# EAGLE design Glyph Reader Rev 1 (EAGLE 9.7.0)

## Sheet 1 of 2
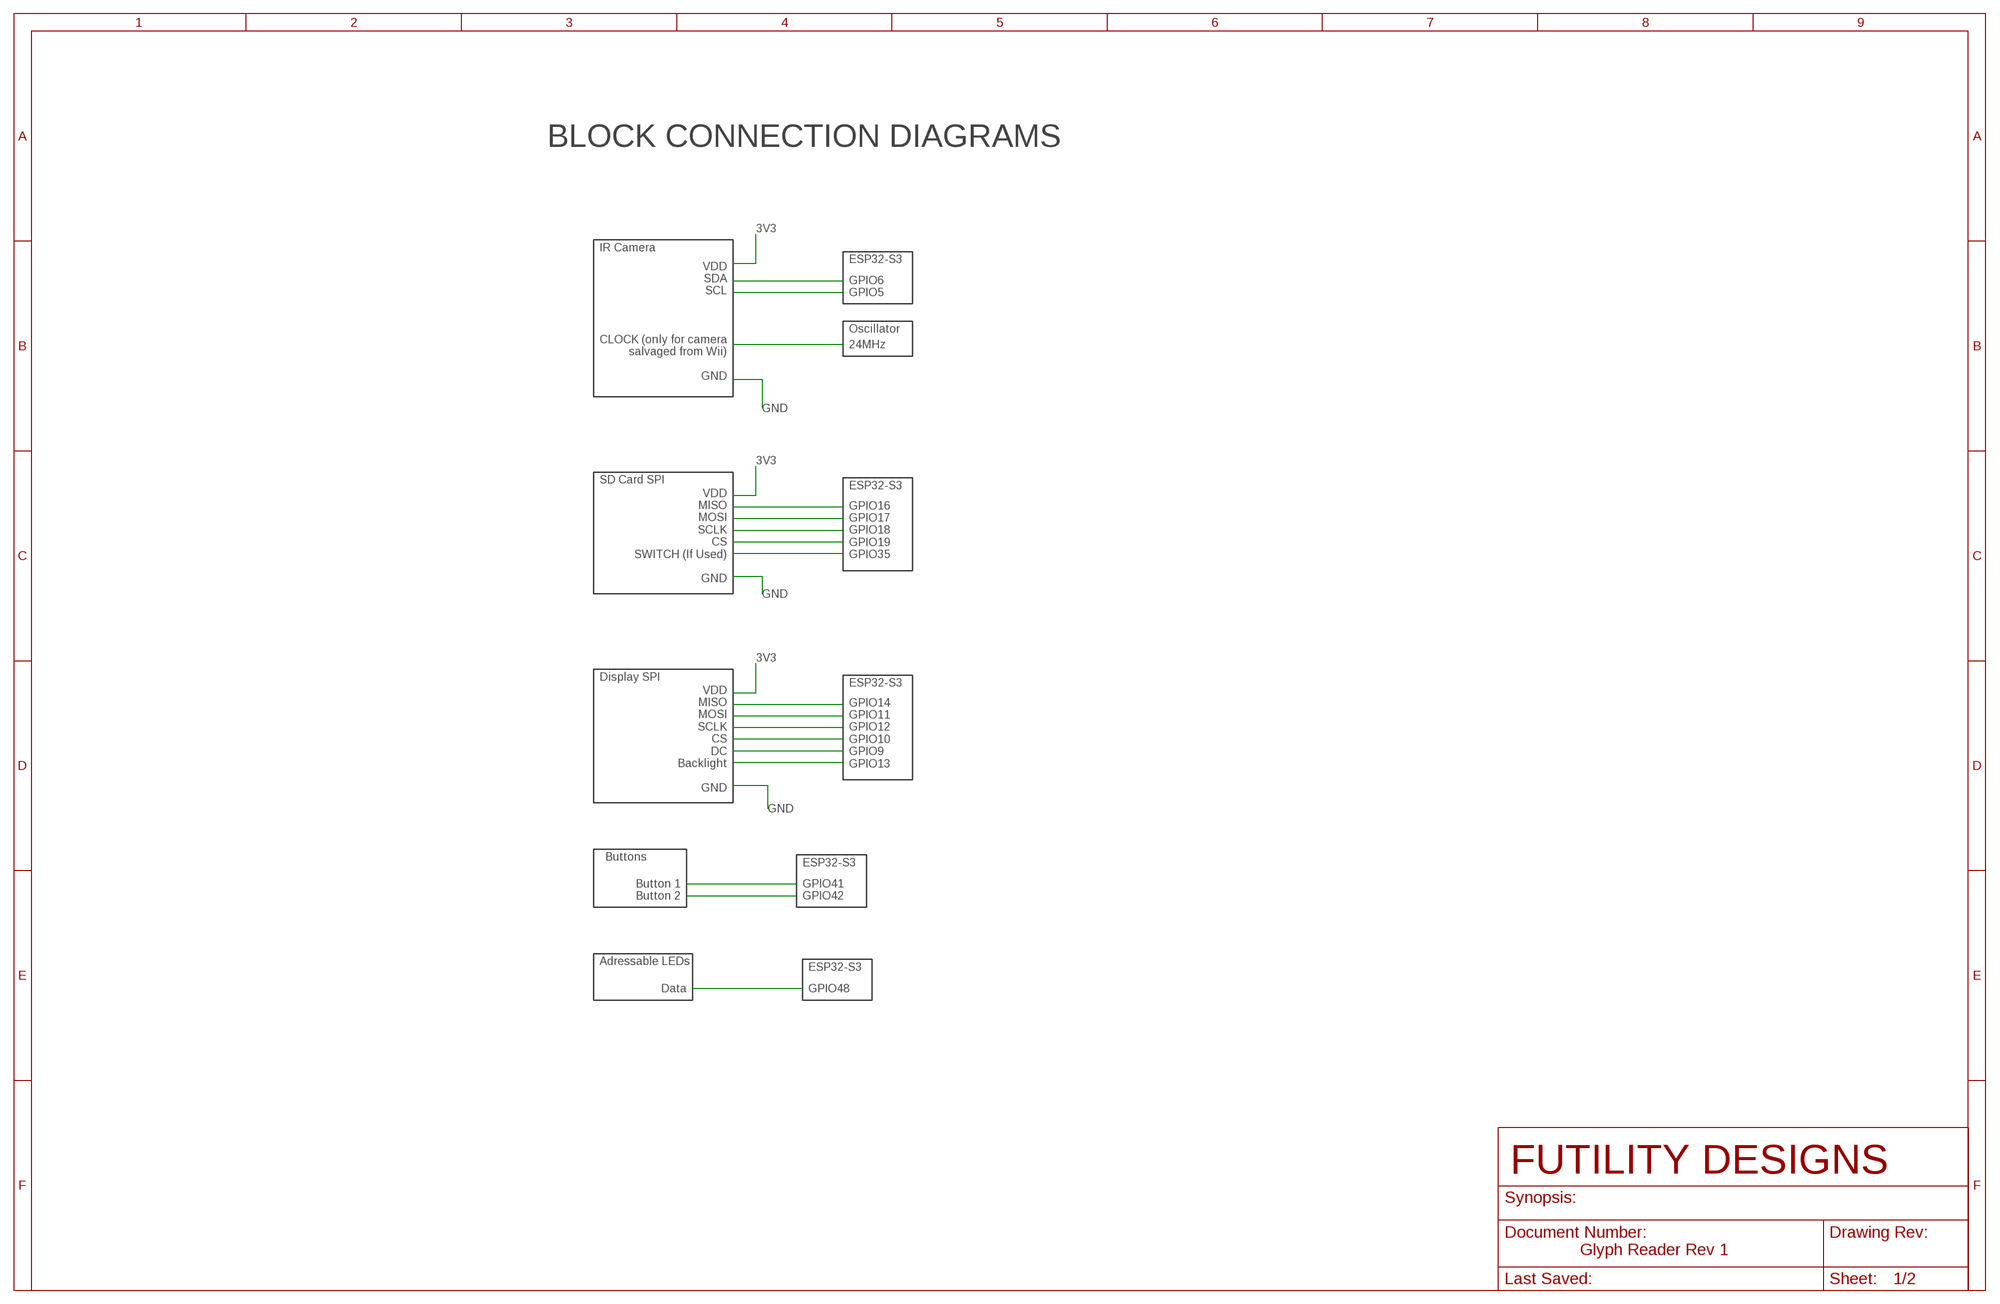
[diagram p0: schematic, sheet 1]

### Notes on the sheet
- BLOCK CONNECTION DIAGRAMS
- 3V3
- IR Camera
- ESP32-S3
- GPIO6
  GPIO5
- VDD
  SDA
  SCL
  
  
  
  CLOCK (only for camera
  salvaged from Wii)
  
  GND
- Oscillator
- 24MHz
- GND
- 3V3
- SD Card SPI
- ESP32-S3
- GPIO16
  GPIO17
  GPIO18
  GPIO19
  GPIO35
- VDD
  MISO
  MOSI
  SCLK
  CS
  SWITCH (If Used)
  
  GND
- GND
- 3V3
- Display SPI
- ESP32-S3
- GPIO14
  GPIO11
  GPIO12
  GPIO10
  GPIO9
  GPIO13
- VDD
  MISO
  MOSI
  SCLK
  CS
  DC
  Backlight
  
  GND
- GND
- Buttons
- ESP32-S3
- Button 1
  Button 2
- GPIO41
  GPIO42
- Adressable LEDs
- ESP32-S3
- Data | GPIO48

## Sheet 2 of 2
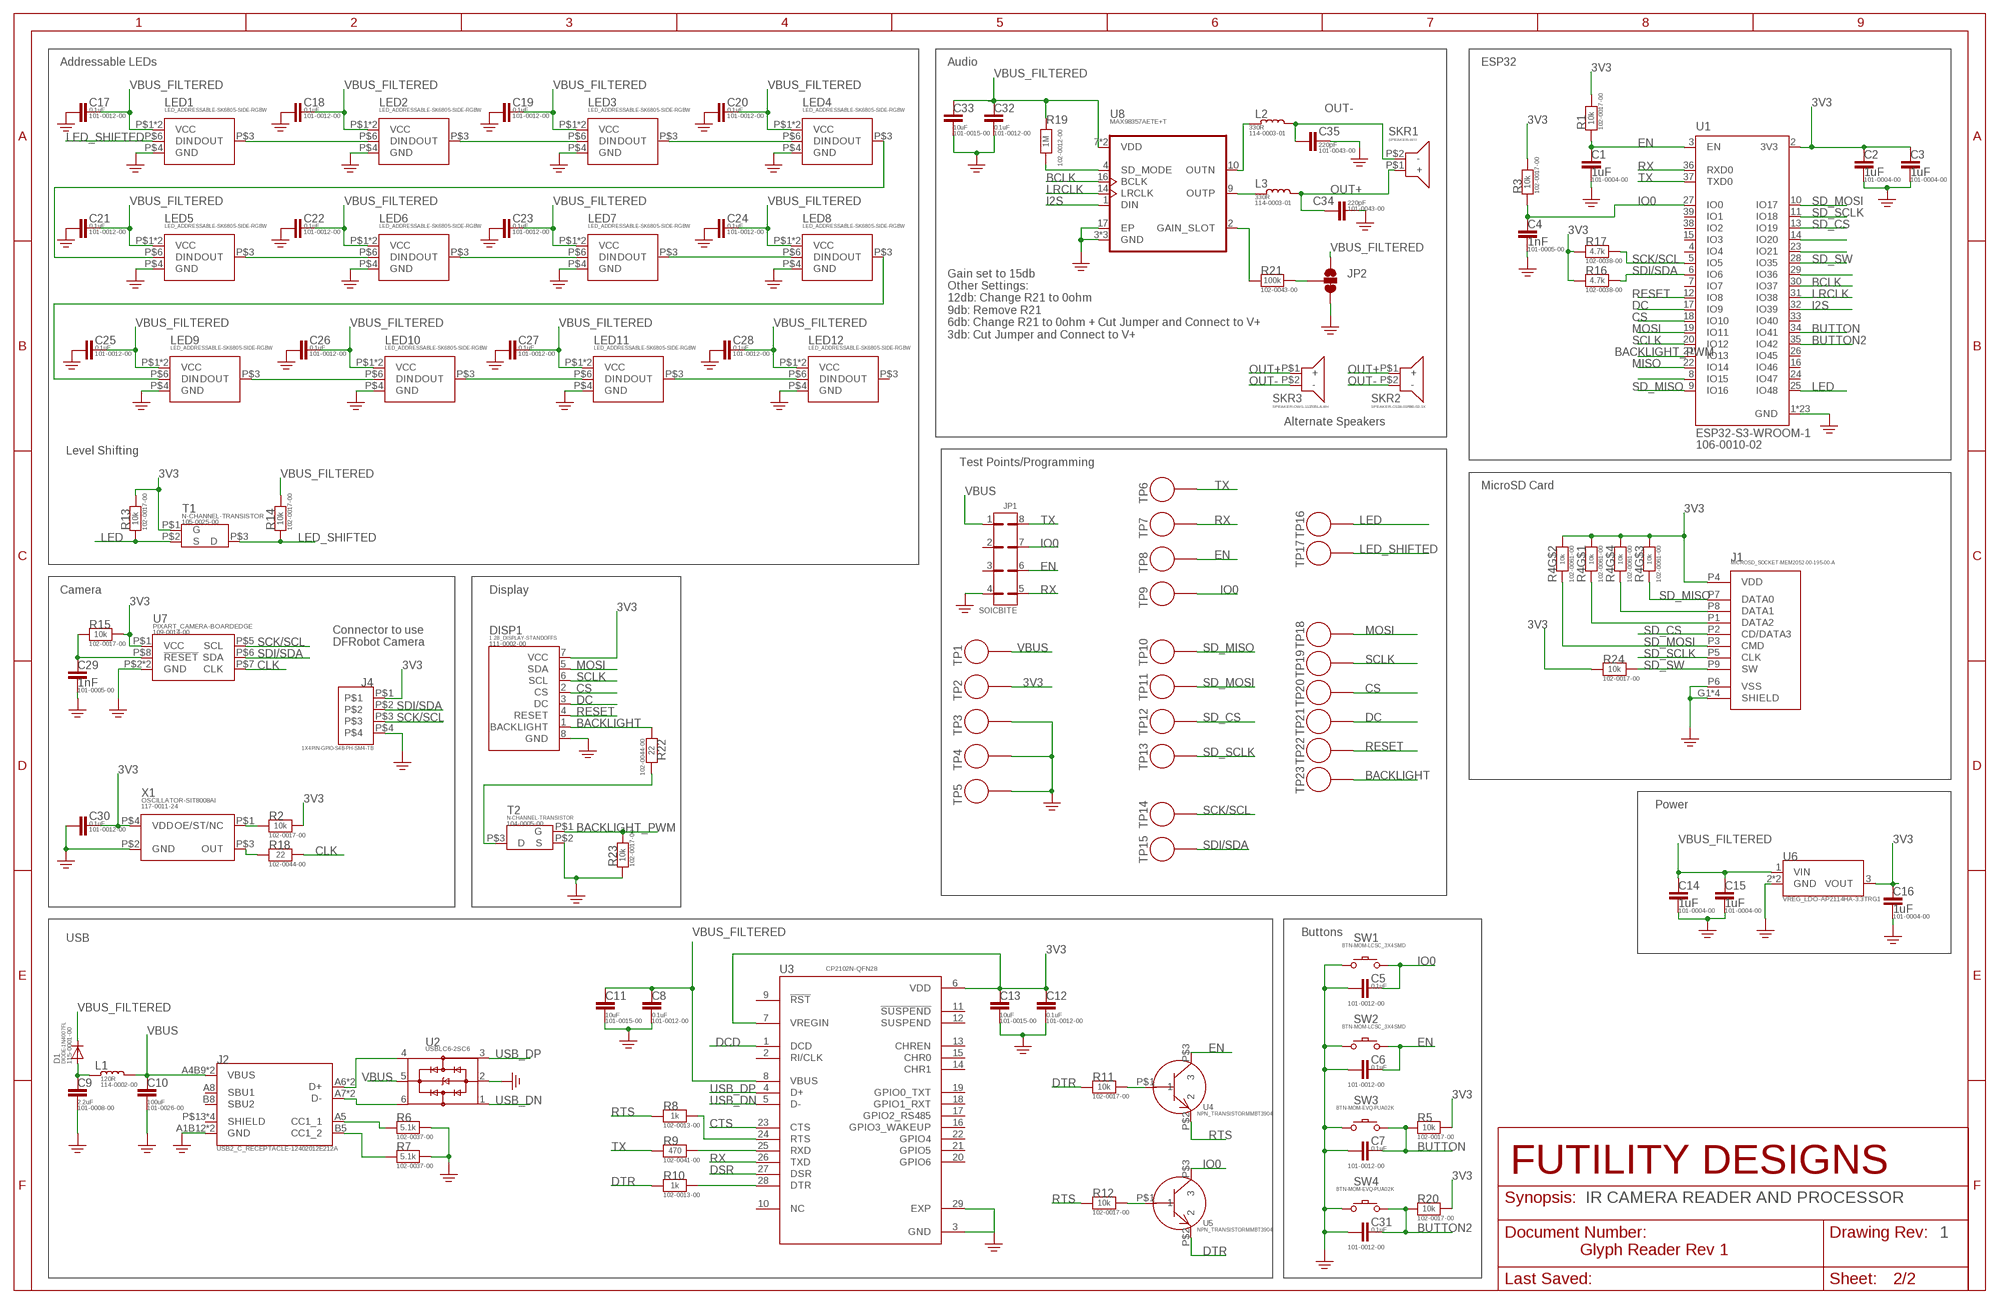
[diagram p1: schematic, sheet 2]
FRAME1 (FRAME_B_L): DOCUMENT_SYNOPSIS: IR CAMERA READER AND PROCESSOR; DRAWING_REV: 1

### Parts
C1  1uF  CAPACITOR-SMD-0402  [0402]
C2  1uF  CAPACITOR-SMD-0402  [0402]
C3  1uF  CAPACITOR-SMD-0402  [0402]
C4  1nF  CAPACITOR-SMD-0402  [0402]
C5  0.1uF  CAPACITOR-SMD-0402  [0402]
C6  0.1uF  CAPACITOR-SMD-0402  [0402]
C7  0.1uF  CAPACITOR-SMD-0402  [0402]
C8  0.1uF  CAPACITOR-SMD-0402  [0402]
C9  2.2uF  CAPACITOR-SMD-0603  [0603]
C10  100uF  CAPACITOR-SMD-1210  [1210]
C11  10uF  CAPACITOR-SMD-0402  [0402]
C12  0.1uF  CAPACITOR-SMD-0402  [0402]
C13  10uF  CAPACITOR-SMD-0402  [0402]
C14  1uF  CAPACITOR-SMD-0402  [0402]
C15  1uF  CAPACITOR-SMD-0402  [0402]
C16  1uF  CAPACITOR-SMD-0402  [0402]
C17  0.1uF  CAPACITOR-SMD-0402  [0402]
C18  0.1uF  CAPACITOR-SMD-0402  [0402]
C19  0.1uF  CAPACITOR-SMD-0402  [0402]
C20  0.1uF  CAPACITOR-SMD-0402  [0402]
C21  0.1uF  CAPACITOR-SMD-0402  [0402]
C22  0.1uF  CAPACITOR-SMD-0402  [0402]
C23  0.1uF  CAPACITOR-SMD-0402  [0402]
C24  0.1uF  CAPACITOR-SMD-0402  [0402]
C25  0.1uF  CAPACITOR-SMD-0402  [0402]
C26  0.1uF  CAPACITOR-SMD-0402  [0402]
C27  0.1uF  CAPACITOR-SMD-0402  [0402]
C28  0.1uF  CAPACITOR-SMD-0402  [0402]
C29  1nF  CAPACITOR-SMD-0402  [0402]
C30  0.1uF  CAPACITOR-SMD-0402  [0402]
C31  0.1uF  CAPACITOR-SMD-0402  [0402]
C32  0.1uF  CAPACITOR-SMD-0402  [0402]
C33  10uF  CAPACITOR-SMD-0402  [0402]
C34  220pF  CAPACITOR-SMD-0402  [0402]
C35  220pF  CAPACITOR-SMD-0402  [0402]
D1  DIODE-1N4007FL  [SOD-123FL]
DISP1  1.28_DISPLAY-STANDOFFS  [1.28ROUNDDISPLAY_STANDOFFS]
J1  MICROSD_SOCKET-MEM2052-00-195-00-A  [GCT_MEM2052-00-195-00-A_REVA]
J2  USB2_C_RECEPTACLE-12402012E212A  [12402012E212A]
J4  1X4PIN-GPIO-S4B-PH-SM4-TB  [S4B-PH-SM4-TB(LF)(SN)]
JP1  SOICBITE  [SOICBITE]
JP2  JUMPER-SMT_3_1-NC_TRACE_NO-SILK  [SMT-JUMPER_3_1-NC_TRACE_NO-SILK]
L1  120R  INDUCTOR0603  [0603]
L2  330R  INDUCTOR0603  [0603]
L3  330R  INDUCTOR0603  [0603]
LED1  LED_ADDRESSABLE-SK6805-SIDE-RGBW  [SK6805SIDE-FRGBW]
LED2  LED_ADDRESSABLE-SK6805-SIDE-RGBW  [SK6805SIDE-FRGBW]
LED3  LED_ADDRESSABLE-SK6805-SIDE-RGBW  [SK6805SIDE-FRGBW]
LED4  LED_ADDRESSABLE-SK6805-SIDE-RGBW  [SK6805SIDE-FRGBW]
LED5  LED_ADDRESSABLE-SK6805-SIDE-RGBW  [SK6805SIDE-FRGBW]
LED6  LED_ADDRESSABLE-SK6805-SIDE-RGBW  [SK6805SIDE-FRGBW]
LED7  LED_ADDRESSABLE-SK6805-SIDE-RGBW  [SK6805SIDE-FRGBW]
LED8  LED_ADDRESSABLE-SK6805-SIDE-RGBW  [SK6805SIDE-FRGBW]
LED9  LED_ADDRESSABLE-SK6805-SIDE-RGBW  [SK6805SIDE-FRGBW]
LED10  LED_ADDRESSABLE-SK6805-SIDE-RGBW  [SK6805SIDE-FRGBW]
LED11  LED_ADDRESSABLE-SK6805-SIDE-RGBW  [SK6805SIDE-FRGBW]
LED12  LED_ADDRESSABLE-SK6805-SIDE-RGBW  [SK6805SIDE-FRGBW]
R1  10k  RESISTOR-SMD0402  [0402]
R2  10k  RESISTOR-SMD0402  [0402]
R3  10k  RESISTOR-SMD0402  [0402]
R4  10k  RESISTOR_4PACK-0804  [RESPACK_4X0402]
R5  10k  RESISTOR-SMD0402  [0402]
R6  5.1k  RESISTOR-SMD0402  [0402]
R7  5.1k  RESISTOR-SMD0402  [0402]
R8  1k  RESISTOR-SMD0402  [0402]
R9  470  RESISTOR-SMD0402  [0402]
R10  1k  RESISTOR-SMD0402  [0402]
R11  10k  RESISTOR-SMD0402  [0402]
R12  10k  RESISTOR-SMD0402  [0402]
R13  10k  RESISTOR-SMD0402  [0402]
R14  10k  RESISTOR-SMD0402  [0402]
R15  10k  RESISTOR-SMD0402  [0402]
R16  4.7k  RESISTOR-SMD0402  [0402]
R17  4.7k  RESISTOR-SMD0402  [0402]
R18  22  RESISTOR-SMD0402  [0402]
R19  1M  RESISTOR-SMD0402  [0402]
R20  10k  RESISTOR-SMD0402  [0402]
R21  100k  RESISTOR-SMD0402  [0402]
R22  22  RESISTOR-SMD0402  [0402]
R23  10k  RESISTOR-SMD0402  [0402]
R24  10k  RESISTOR-SMD0402  [0402]
SKR1  SPEAKER-WII  [WIIMOTE_SPEAKER]
SKR2  SPEAKER-CS18-01R80-02-1X  [CS18-01R80-02-1X]
SKR3  SPEAKER-OWS-111535LA-8H  [OWS-111535LA-8H]
SW1  BTN-MOM-LCSC_3X4SMD  [3X4SMD]
SW2  BTN-MOM-LCSC_3X4SMD  [3X4SMD]
SW3  BTN-MOM-EVQ-PUA02K  [EVQ-PUA02K]
SW4  BTN-MOM-EVQ-PUA02K  [EVQ-PUA02K]
T1  N-CHANNEL-TRANSISTOR  [SOT23]
T2  N-CHANNEL-TRANSISTOR  [SOT23]
TP1  POGO_LANDING_PADP25-4023  [HARWIN_LANDING_P25-4023]
TP2  POGO_LANDING_PADP25-4023  [HARWIN_LANDING_P25-4023]
TP3  POGO_LANDING_PADP25-4023  [HARWIN_LANDING_P25-4023]
TP4  POGO_LANDING_PADP25-4023  [HARWIN_LANDING_P25-4023]
TP5  POGO_LANDING_PADP25-4023  [HARWIN_LANDING_P25-4023]
TP6  POGO_LANDING_PADP25-0123  [HARWIN_LANDING_P25-01_20MIL]
TP7  POGO_LANDING_PADP25-0123  [HARWIN_LANDING_P25-01_20MIL]
TP8  POGO_LANDING_PADP25-0123  [HARWIN_LANDING_P25-01_20MIL]
TP9  POGO_LANDING_PADP25-0123  [HARWIN_LANDING_P25-01_20MIL]
TP10  POGO_LANDING_PADP25-0123  [HARWIN_LANDING_P25-01_20MIL]
TP11  POGO_LANDING_PADP25-0123  [HARWIN_LANDING_P25-01_20MIL]
TP12  POGO_LANDING_PADP25-0123  [HARWIN_LANDING_P25-01_20MIL]
TP13  POGO_LANDING_PADP25-0123  [HARWIN_LANDING_P25-01_20MIL]
TP14  POGO_LANDING_PADP25-0123  [HARWIN_LANDING_P25-01_20MIL]
TP15  POGO_LANDING_PADP25-0123  [HARWIN_LANDING_P25-01_20MIL]
TP16  POGO_LANDING_PADP25-0123  [HARWIN_LANDING_P25-01_20MIL]
TP17  POGO_LANDING_PADP25-0123  [HARWIN_LANDING_P25-01_20MIL]
TP18  POGO_LANDING_PADP25-0123  [HARWIN_LANDING_P25-01_20MIL]
TP19  POGO_LANDING_PADP25-0123  [HARWIN_LANDING_P25-01_20MIL]
TP20  POGO_LANDING_PADP25-0123  [HARWIN_LANDING_P25-01_20MIL]
TP21  POGO_LANDING_PADP25-0123  [HARWIN_LANDING_P25-01_20MIL]
TP22  POGO_LANDING_PADP25-0123  [HARWIN_LANDING_P25-01_20MIL]
TP23  POGO_LANDING_PADP25-0123  [HARWIN_LANDING_P25-01_20MIL]
U1  ESP32-S3-WROOM-1  [ESP32-S3-WROOM-1]
U2  USBLC6-2SC6  [SOT95P280X145-6N]
U3  CP2102N-QFN28  [IC_CP2102N-A02-GQFN28R]
U4  NPN_TRANSISTORMMBT3904  [SOT23]
U5  NPN_TRANSISTORMMBT3904  [SOT23]
U6  VREG_LDO-AP2114HA-3.3TRG1  [SOT-223_DIO]
U7  PIXART_CAMERA-BOARDEDGE  [PIXART_CAMERA_BOARDEDGE]
U8  MAX98357AETE+T  [QFN50P300X300X80-17N]
X1  OSCILLATOR-SIT8008AI  [SIT8008AI-1X]

### Nets
3V3: C2.P$1 C3.P$1 C12.P$1 C13.P$1 C16.P$1 C30.P$2 DISP1.7(VCC) J1.P4(VDD) J4.P$1 R1.P$2 R2.P$2 R3.P$2 R4.5 R4.6 R4.7 R4.8 R5.P$2 R13.P$2 R15.P$2 R16.P$1 R17.P$1 R20.P$2 R24.P$1 T1.P$1(G) TP2.P$1(P1) U1.2(3V3) U3.6(VDD) U3.7(VREGIN) U6.3(VOUT) U7.P$1(VCC) X1.P$4(VDD)
BACKLIGHT: DISP1.1(BACKLIGHT) R22.P$1 TP23.P$1(P1)
BACKLIGHT_PWM: R23.P$2 T2.P$1(G) U1.21(IO13)
BCLK: U1.30(IO37) U8.16(BCLK)
BUTTON: C7.P$2 R5.P$1 SW3.P$2 SW3.P$4 U1.34(IO41)
BUTTON2: C31.P$2 R20.P$1 SW4.P$2 SW4.P$4 U1.35(IO42)
CLK: R18.P$2 U7.P$7(CLK)
CS: DISP1.2(CS) TP20.P$1(P1) U1.18(IO10)
CTS: U3.23(CTS)
DC: DISP1.3(DC) TP21.P$1(P1) U1.17(IO9)
DCD: U3.1(DCD)
DSR: U3.27(DSR)
DTR: R10.P$1 R11.P$1 U5.P$2
EN: C1.P$1 C6.P$2 JP1.6 R1.P$1 SW2.P$2 TP8.P$1(P1) U1.3(EN) U4.P$3
GND: C1.P$2 C2.P$2 C3.P$2 C4.P$2 C5.P$1 C6.P$1 C7.P$1 C8.P$2 C9.P$2 C10.P$2 C11.P$2 C12.P$2 C13.P$2 C14.P$2 C15.P$2 C16.P$2 C17.P$1 C18.P$1 C19.P$1 C20.P$1 C21.P$1 C22.P$1 C23.P$1 C24.P$1 C25.P$1 C26.P$1 C27.P$1 C28.P$1 C29.P$2 C30.P$1 C31.P$1 C32.P$2 C33.P$2 C34.P$2 C35.P$2 DISP1.8(GND) J1.G1(SHIELD) J1.G2(SHIELD) J1.G3(SHIELD) J1.G4(SHIELD) J1.P6(VSS) J2.A1B12(GND) J2.B1A12(GND) J4.P$4 JP1.4 JP2.3 LED1.P$4(GND) LED2.P$4(GND) LED3.P$4(GND) LED4.P$4(GND) LED5.P$4(GND) LED6.P$4(GND) LED7.P$4(GND) LED8.P$4(GND) LED9.P$4(GND) LED10.P$4(GND) LED11.P$4(GND) LED12.P$4(GND) R6.P$2 R7.P$2 R23.P$1 SW1.P$1 SW2.P$1 SW3.P$1 SW3.P$3 SW4.P$1 SW4.P$3 T2.P$2(S) TP3.P$1(P1) TP4.P$1(P1) TP5.P$1(P1) U1.1(GND) U1.40(GND) U1.41_1(GND) U1.41_2(GND) U1.41_3(GND) U1.41_4(GND) U1.41_5(GND) U1.41_6(GND) U1.41_7(GND) U1.41_8(GND) U1.41_9(GND) U1.41_10(GND) U1.41_11(GND) U1.41_12(GND) U1.41_13(GND) U1.41_14(GND) U1.41_15(GND) U1.41_16(GND) U1.41_17(GND) U1.41_18(GND) U1.41_19(GND) U1.41_20(GND) U1.41_21(GND) U2.2(GND) U3.3(GND) U3.29(EXP) U6.2(GND) U6.4(GND) U7.P$2(GND) U7.P$3(GND) U8.3(GND) U8.11(GND) U8.15(GND) U8.17(EP) X1.P$2(GND)
I2S: U1.32(IO39) U8.1(DIN)
IO0: C4.P$1 C5.P$2 JP1.7 R3.P$1 SW1.P$2 TP9.P$1(P1) U1.27(IO0) U5.P$3
LED: R13.P$1 T1.P$2(S) TP16.P$1(P1) U1.25(IO48)
LED_SHIFTED: LED1.P$6(DIN) R14.P$1 T1.P$3(D) TP17.P$1(P1)
LRCLK: U1.31(IO38) U8.14(LRCLK)
MISO: U1.22(IO14)
MOSI: DISP1.5(SDA) TP18.P$1(P1) U1.19(IO11)
N$1: R18.P$1 X1.P$3(OUT)
N$2: J2.A6(D+) J2.B6(D+) U2.4(I/O2_OUT)
N$3: J1.P8(DATA1) R4.4
N$4: J1.P1(DATA2) R4.1
N$5: C9.P$1 D1.P$2(ANODE) L1.P$1
N$6: J2.A7(D-) J2.B7(D-) U2.6(I/O1_OUT)
N$7: J2.A5(CC1_1) R6.P$1
N$8: J2.B5(CC1_2) R7.P$1
N$9: R11.P$2 U4.P$1
N$10: R12.P$2 U5.P$1
N$11: U1.8(IO15)
N$13: LED1.P$3(DOUT) LED2.P$6(DIN)
N$14: LED2.P$3(DOUT) LED3.P$6(DIN)
N$15: LED3.P$3(DOUT) LED4.P$6(DIN)
N$16: R8.P$2 U3.24(RTS)
N$17: R9.P$2 U3.25(RXD)
N$18: LED4.P$3(DOUT) LED5.P$6(DIN)
N$19: LED5.P$3(DOUT) LED6.P$6(DIN)
N$20: R10.P$2 U3.28(DTR)
N$21: LED6.P$3(DOUT) LED7.P$6(DIN)
N$22: LED9.P$3(DOUT) LED10.P$6(DIN)
N$23: LED8.P$3(DOUT) LED9.P$6(DIN)
N$24: LED7.P$3(DOUT) LED8.P$6(DIN)
N$25: LED11.P$3(DOUT) LED12.P$6(DIN)
N$26: LED10.P$3(DOUT) LED11.P$6(DIN)
N$28: C29.P$1 R15.P$1 U7.P$8(!RESET)
N$32: R2.P$1 X1.P$1(OE/ST/NC)
N$34: JP2.2 R21.P$2
N$36: R19.P$2 U8.4(SD_MODE)
N$37: R22.P$2 T2.P$3(D)
N$41: L2.P$1 U8.10(OUTN)
N$42: L3.P$1 U8.9(OUTP)
N$43: R21.P$1 U8.2(GAIN_SLOT)
N$44: U1.14(IO20)
N$45: U1.23(IO21)
N$46: U1.29(IO36)
OUT+: C34.P$1 L3.P$2 SKR1.P$1(+) SKR2.P$1(+) SKR3.P$1(+)
OUT-: C35.P$1 L2.P$2 SKR1.P$2(-) SKR2.P$2(-) SKR3.P$2(-)
RESET: DISP1.4(RESET) TP22.P$1(P1) U1.12(IO8)
RTS: R8.P$1 R12.P$1 U4.P$2
RX: JP1.5 TP7.P$1(P1) U1.36(RXD0) U3.26(TXD)
SCK/SCL: J4.P$3 R17.P$2 TP14.P$1(P1) U1.5(IO5) U7.P$5(SCL)
SCLK: DISP1.6(SCL) TP19.P$1(P1) U1.20(IO12)
SD_CS: J1.P2(CD/DATA3) TP12.P$1(P1) U1.13(IO19)
SD_MISO: J1.P7(DATA0) R4.3 TP10.P$1(P1) U1.9(IO16)
SD_MOSI: J1.P3(CMD) R4.2 TP11.P$1(P1) U1.10(IO17)
SD_SCLK: J1.P5(CLK) TP13.P$1(P1) U1.11(IO18)
SD_SW: J1.P9(SW) R24.P$2 U1.28(IO35)
SDI/SDA: J4.P$2 R16.P$2 TP15.P$1(P1) U1.6(IO6) U7.P$6(SDA)
TX: JP1.8 R9.P$1 TP6.P$1(P1) U1.37(TXD0)
USB_DN: U2.1(I/O1_IN) U3.5(D-)
USB_DP: U2.3(I/O2_IN) U3.4(D+)
VBUS: C10.P$1 J2.A4B9(VBUS) J2.B4A9(VBUS) JP1.1 L1.P$2 TP1.P$1(P1) U2.5(VBUS)
VBUS_FILTERED: C8.P$1 C11.P$1 C14.P$1 C15.P$1 C17.P$2 C18.P$2 C19.P$2 C20.P$2 C21.P$2 C22.P$2 C23.P$2 C24.P$2 C25.P$2 C26.P$2 C27.P$2 C28.P$2 C32.P$1 C33.P$1 D1.P$1(CATHODE) JP2.1 LED1.P$1(VCC) LED1.P$5(VCC) LED2.P$1(VCC) LED2.P$5(VCC) LED3.P$1(VCC) LED3.P$5(VCC) LED4.P$1(VCC) LED4.P$5(VCC) LED5.P$1(VCC) LED5.P$5(VCC) LED6.P$1(VCC) LED6.P$5(VCC) LED7.P$1(VCC) LED7.P$5(VCC) LED8.P$1(VCC) LED8.P$5(VCC) LED9.P$1(VCC) LED9.P$5(VCC) LED10.P$1(VCC) LED10.P$5(VCC) LED11.P$1(VCC) LED11.P$5(VCC) LED12.P$1(VCC) LED12.P$5(VCC) R14.P$2 R19.P$1 U3.8(VBUS) U6.1(VIN) U8.7(VDD) U8.8(VDD)
Unconnected: J2.A8(SBU1) J2.B8(SBU2) J2.P$13(SHIELD) J2.P$14(SHIELD) J2.P$15(SHIELD) J2.P$16(SHIELD) JP1.2 JP1.3 LED12.P$3(DOUT) U1.4(IO4) U1.7(IO7) U1.15(IO3) U1.16(IO46) U1.24(IO47) U1.26(IO45) U1.33(IO40) U1.38(IO2) U1.39(IO1) U3.2(RI/CLK) U3.9(!RST) U3.10(NC) U3.11(!SUSPEND) U3.12(SUSPEND) U3.13(CHREN) U3.14(CHR1) U3.15(CHR0) U3.16(GPIO3_WAKEUP) U3.17(GPIO2_RS485) U3.18(GPIO1_RXT) U3.19(GPIO0_TXT) U3.20(GPIO6) U3.21(GPIO5) U3.22(GPIO4)

### Notes on the sheet
- Addressable LEDs | Audio | ESP32
- Gain set to 15db
  Other Settings:
  12db: Change R21 to 0ohm
  9db: Remove R21
  6db: Change R21 to 0ohm + Cut Jumper and Connect to V+
  3db: Cut Jumper and Connect to V+
- Alternate Speakers
- Level Shifting
- Test Points/Programming
- MicroSD Card
- Camera | Display
- Connector to use
  DFRobot Camera
- Power
- Buttons
- USB

## Library data of the parts
C1-C3 C14-C16 = 1-chris-parts:CAPACITOR-SMD; PART_NUMBER: 101-0004-00
C4 C29 = 1-chris-parts:CAPACITOR-SMD; PART_NUMBER: 101-0005-00
C5-C8 C12 C17-C28 C30-C32 = 1-chris-parts:CAPACITOR-SMD; PART_NUMBER: 101-0012-00
C9 = 1-chris-parts:CAPACITOR-SMD; PART_NUMBER: 101-0008-00
C10 = 1-chris-parts:CAPACITOR-SMD; PART_NUMBER: 101-0026-00
C11 C13 C33 = 1-chris-parts:CAPACITOR-SMD; PART_NUMBER: 101-0015-00
C34 C35 = 1-chris-parts:CAPACITOR-SMD; PART_NUMBER: 101-0043-00
D1 = 1-chris-parts:DIODE; PART_NUMBER: 115-0001-00
DISP1 = 1-Chris-displays:1.28_DISPLAY; PART_NUMBER: 111-0002-00
J1 = 1-Chris-Connectors:MICROSD_SOCKET: 1.10mm Pitch microSD Card Connector, Push-Push Type, with VSS (Supply Voltage Ground) Detect Switch, Lead-Free
J2 = 1-chris-parts:USB2_C_RECEPTACLE
J4 = 1-chris-parts:1X4PIN-GPIO
JP1 = 1-chris-parts:SOICBITE: SOICbite footprint Allows for direct clipping of a SOIC-8 Testclip onto a PCB edge for Programming/Debugging purposes without extra components. Original footprint created by: Simon Merrit Adapted to Eagle by: Chiel Voswijk (Foxhood) NOTE: Footprint is to be used on the edge of a PCB and may require the use of thin traces for accessing the inner pads. This may violate some Design Rules! One can often ignore these, but understand working is NOT guaranteed.
JP2 = SparkFun-Jumpers:JUMPER-SMT_3_1-NC_TRACE: Normally closed trace jumper (1 of 2 connections) This jumper has a trace between two pads so it's normally closed (NC). The other connection is normally open (NO). Use a razor knife to open the connection. For best results follow the IPC guidelines for cutting traces: Cutout at least 0.063 mm (0.005 in). Remove all loose material to clean up the cut area. Seal the cut with an approved epoxy. Reapply solder to reclose the connection, or to close the NO connection.
L1 = 1-chris-parts:INDUCTOR: Inductors 0603: 10nH Ceramic Inductor - microwire antenna/RF (Digikey: 712-1434-2-ND) 0805: 560nH Ceramic Inductor - RF (Digikey: 553-1047-1-ND) 270nH Ceramic Inductor - Q = 40@250MHz, +-5%, 1 Ohm DC Resistance (Digikey: 535-10506-2-ND) 1007 (2518 Metric) SMT: 10µH 10% 250mOhm 820mA 1007 Inductor (Digikey: 587-2189-1-ND) 22µH 10% 500mOhm 580mA 1007 Inductor (Digikey: 587-2190-1-ND) 47µH 10% 950mOhm 420mA 1007 Inductor (Digikey: 587-2191-1-ND) 47µH 5% 100mOhm 1A 1008 Inductor (Digikey: 732-1816-1-ND) 5.0x5.0mm (Taiyo Yuden NR5040 Series) 6.8µH 20% 2.3A 64mOhm Inductor (Digikey: 587-2374-2-ND) 5.0x5.0mm (TDK VLC5045 Series) 4.7µH 20% 3.3A 34mOhm Inductor (Digikey: 445-6526-1-ND) 6.8µH 20% 2.7A 46mOhm Inductor (Digikey: 445-6527-1-ND) 6.0x6.0mm (TDK VLC6045 Series) 4.7µH 20% 3.8A 27mOhm Inductor (Digikey: 445-6538-2-ND) 6.8µH 20% 3A 41mOhm Inductor (Digikey: 445-6540-1-ND) 6.2µH 30% 2.2A 45mOhm Inductor (Digikey: SRR5028-6R2YCT-ND) - Not TDK VLC6045 but footprint should match 6.0x6.0mm (TDK SLF6045 Series) 6.8uH 30% 2A 33mOhm Inductor (Digikey: 445-4572-1-ND, Mouser: 810-SLF645T6R8N2R0PF) 6.0x6.0mm (Sumida CDRH5D28 Series) 6.2uH 30% 1.8A 45mOhm Inductor (Digikey: 308-1542-1-ND) Taiyo Yuden NR3015T2R2M - 2.2uH 20% 1.5A (Digikey: 587-1648-2-ND, Mouser: 963-NR3015T2R2M) - Used with TI TPS62172 CoilCraft RFID Transponder Coil - MA5532-AE (For use with AS3935 Lightning Sensor) Vishay IHLP 1.0uH Molded Inductor - 24mOhm DCR, 5A, +/-20%, -55°C-125°C (Digikey: 541-1319-1-ND); PART_NUMBER: 114-0002-00
L2 L3 = 1-chris-parts:INDUCTOR: Inductors 0603: 10nH Ceramic Inductor - microwire antenna/RF (Digikey: 712-1434-2-ND) 0805: 560nH Ceramic Inductor - RF (Digikey: 553-1047-1-ND) 270nH Ceramic Inductor - Q = 40@250MHz, +-5%, 1 Ohm DC Resistance (Digikey: 535-10506-2-ND) 1007 (2518 Metric) SMT: 10µH 10% 250mOhm 820mA 1007 Inductor (Digikey: 587-2189-1-ND) 22µH 10% 500mOhm 580mA 1007 Inductor (Digikey: 587-2190-1-ND) 47µH 10% 950mOhm 420mA 1007 Inductor (Digikey: 587-2191-1-ND) 47µH 5% 100mOhm 1A 1008 Inductor (Digikey: 732-1816-1-ND) 5.0x5.0mm (Taiyo Yuden NR5040 Series) 6.8µH 20% 2.3A 64mOhm Inductor (Digikey: 587-2374-2-ND) 5.0x5.0mm (TDK VLC5045 Series) 4.7µH 20% 3.3A 34mOhm Inductor (Digikey: 445-6526-1-ND) 6.8µH 20% 2.7A 46mOhm Inductor (Digikey: 445-6527-1-ND) 6.0x6.0mm (TDK VLC6045 Series) 4.7µH 20% 3.8A 27mOhm Inductor (Digikey: 445-6538-2-ND) 6.8µH 20% 3A 41mOhm Inductor (Digikey: 445-6540-1-ND) 6.2µH 30% 2.2A 45mOhm Inductor (Digikey: SRR5028-6R2YCT-ND) - Not TDK VLC6045 but footprint should match 6.0x6.0mm (TDK SLF6045 Series) 6.8uH 30% 2A 33mOhm Inductor (Digikey: 445-4572-1-ND, Mouser: 810-SLF645T6R8N2R0PF) 6.0x6.0mm (Sumida CDRH5D28 Series) 6.2uH 30% 1.8A 45mOhm Inductor (Digikey: 308-1542-1-ND) Taiyo Yuden NR3015T2R2M - 2.2uH 20% 1.5A (Digikey: 587-1648-2-ND, Mouser: 963-NR3015T2R2M) - Used with TI TPS62172 CoilCraft RFID Transponder Coil - MA5532-AE (For use with AS3935 Lightning Sensor) Vishay IHLP 1.0uH Molded Inductor - 24mOhm DCR, 5A, +/-20%, -55°C-125°C (Digikey: 541-1319-1-ND); PART_NUMBER: 114-0003-01
LED1-LED12 = 1-chris-parts:LED_ADDRESSABLE
R1-R3 R5 R11-R15 R20 R23 R24 = 1-chris-parts:RESISTOR-SMD; PART_NUMBER: 102-0017-00
R4 = 1-chris-parts:RESISTOR_4PACK: Resistor Packs (4 resistors) 4 x 0603 10K 1/16W - Digikey: YC164J-10KCT-ND; PART_NUMBER: 102-0061-00
R6 R7 = 1-chris-parts:RESISTOR-SMD; PART_NUMBER: 102-0037-00
R8 R10 = 1-chris-parts:RESISTOR-SMD; PART_NUMBER: 102-0013-00
R9 = 1-chris-parts:RESISTOR-SMD; PART_NUMBER: 102-0041-00
R16 R17 = 1-chris-parts:RESISTOR-SMD; PART_NUMBER: 102-0038-00
R18 R22 = 1-chris-parts:RESISTOR-SMD; PART_NUMBER: 102-0044-00
R19 = 1-chris-parts:RESISTOR-SMD; PART_NUMBER: 102-0012-00
R21 = 1-chris-parts:RESISTOR-SMD; PART_NUMBER: 102-0043-00
SKR1-SKR3 = 1-chris-parts:SPEAKER
SW1-SW4 = 1-chris-parts:BTN-MOM
T1 = 1-chris-parts:N-CHANNEL-TRANSISTOR; PART_NUMBER: 105-0025-00
T2 = 1-chris-parts:N-CHANNEL-TRANSISTOR; PART_NUMBER: 104-0005-00
TP1-TP23 = 1-chris-parts:POGO_LANDING_PAD
U1 = 1-Chris-Micros-SBC:ESP32-S3-WROOM-1; PART_NUMBER: 106-0010-02
U2 = 1-chris-parts:USBLC6-2SC6: Check availability <https://pricing.snapeda.com/parts/USBLC6-2SC6/STMicroelectronics/view-part?ref=eda> Check availability <https://pricing.snapeda.com/parts/USBLC6-2SC6/STMicroelectronics/view-part?ref=eda>
U3 = 1-chris-parts:CP2102N-QFN28
U4 U5 = 1-chris-parts:NPN_TRANSISTOR
U6 = 1-chris-parts:VREG_LDO
U7 = 1-Chris-Sensors:PIXART_CAMERA; PART_NUMBER: 109-0014-00
U8 = 1-chris-parts:MAX98357AETE+T
X1 = 1-chris-parts:OSCILLATOR; PART_NUMBER: 117-0011-24

## Board
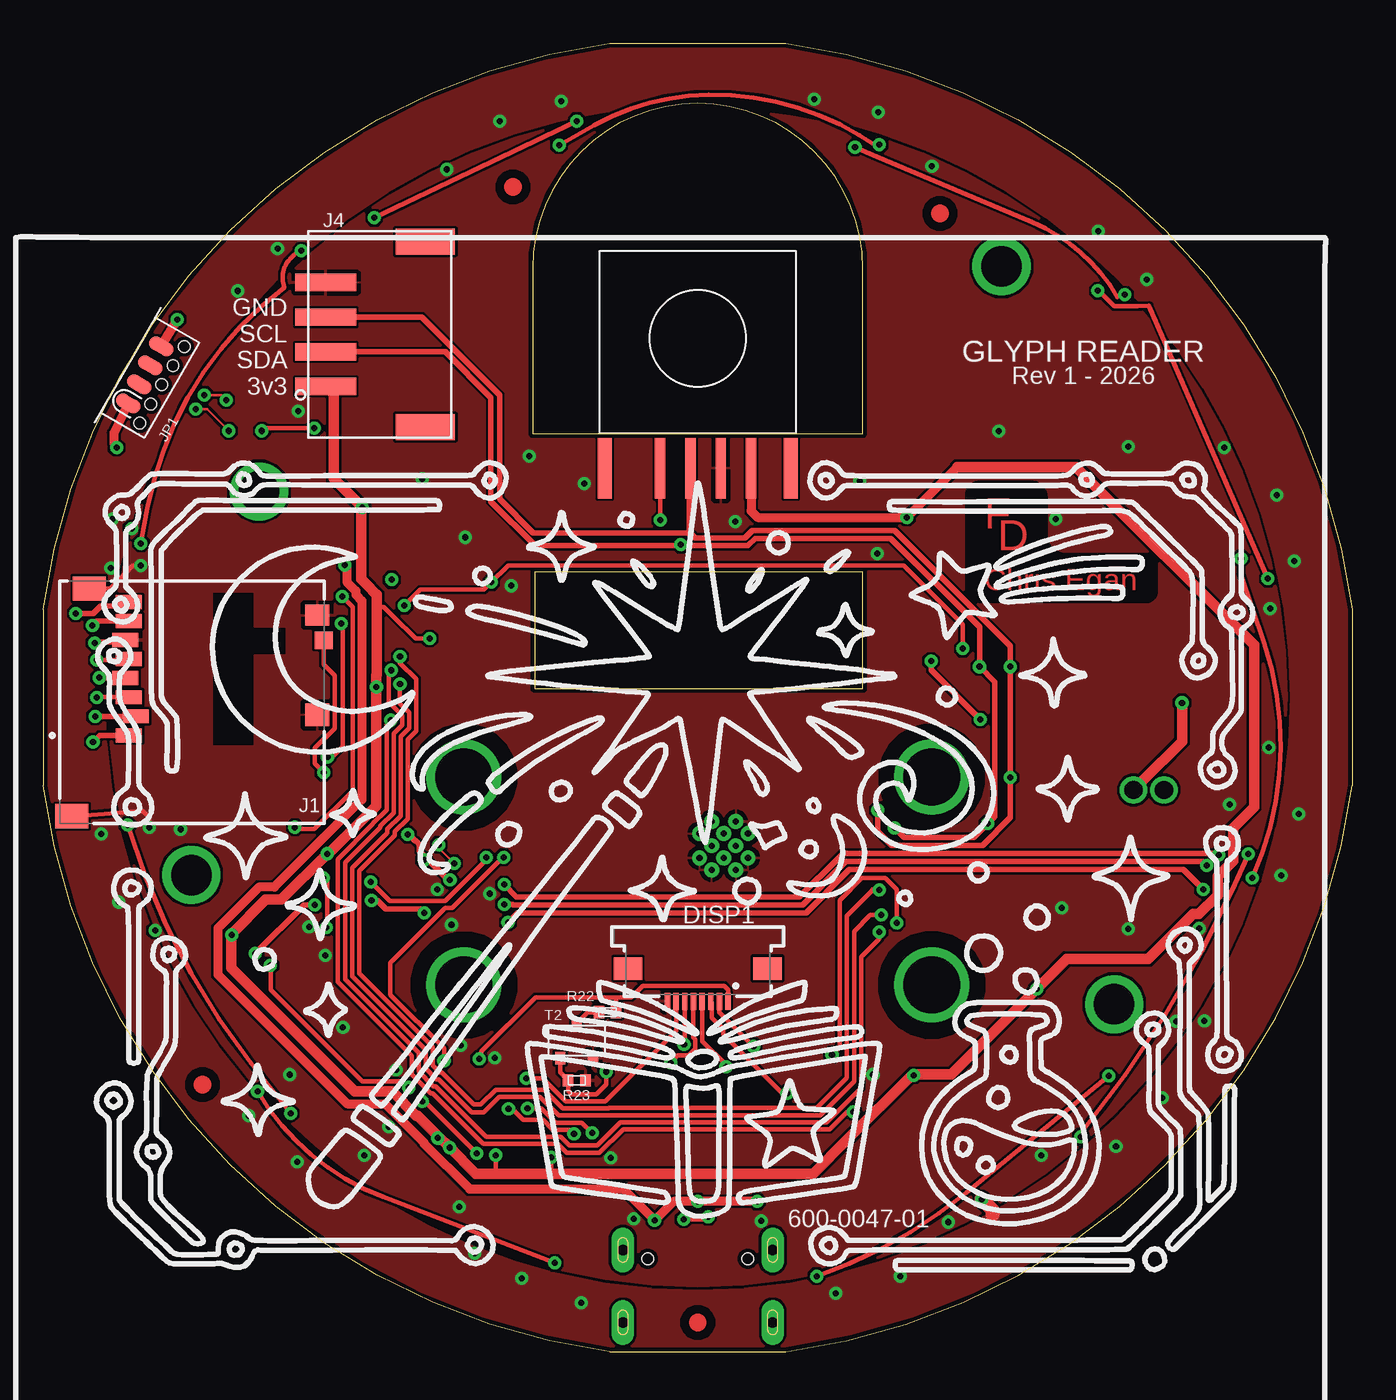
[diagram p2: board, top side]
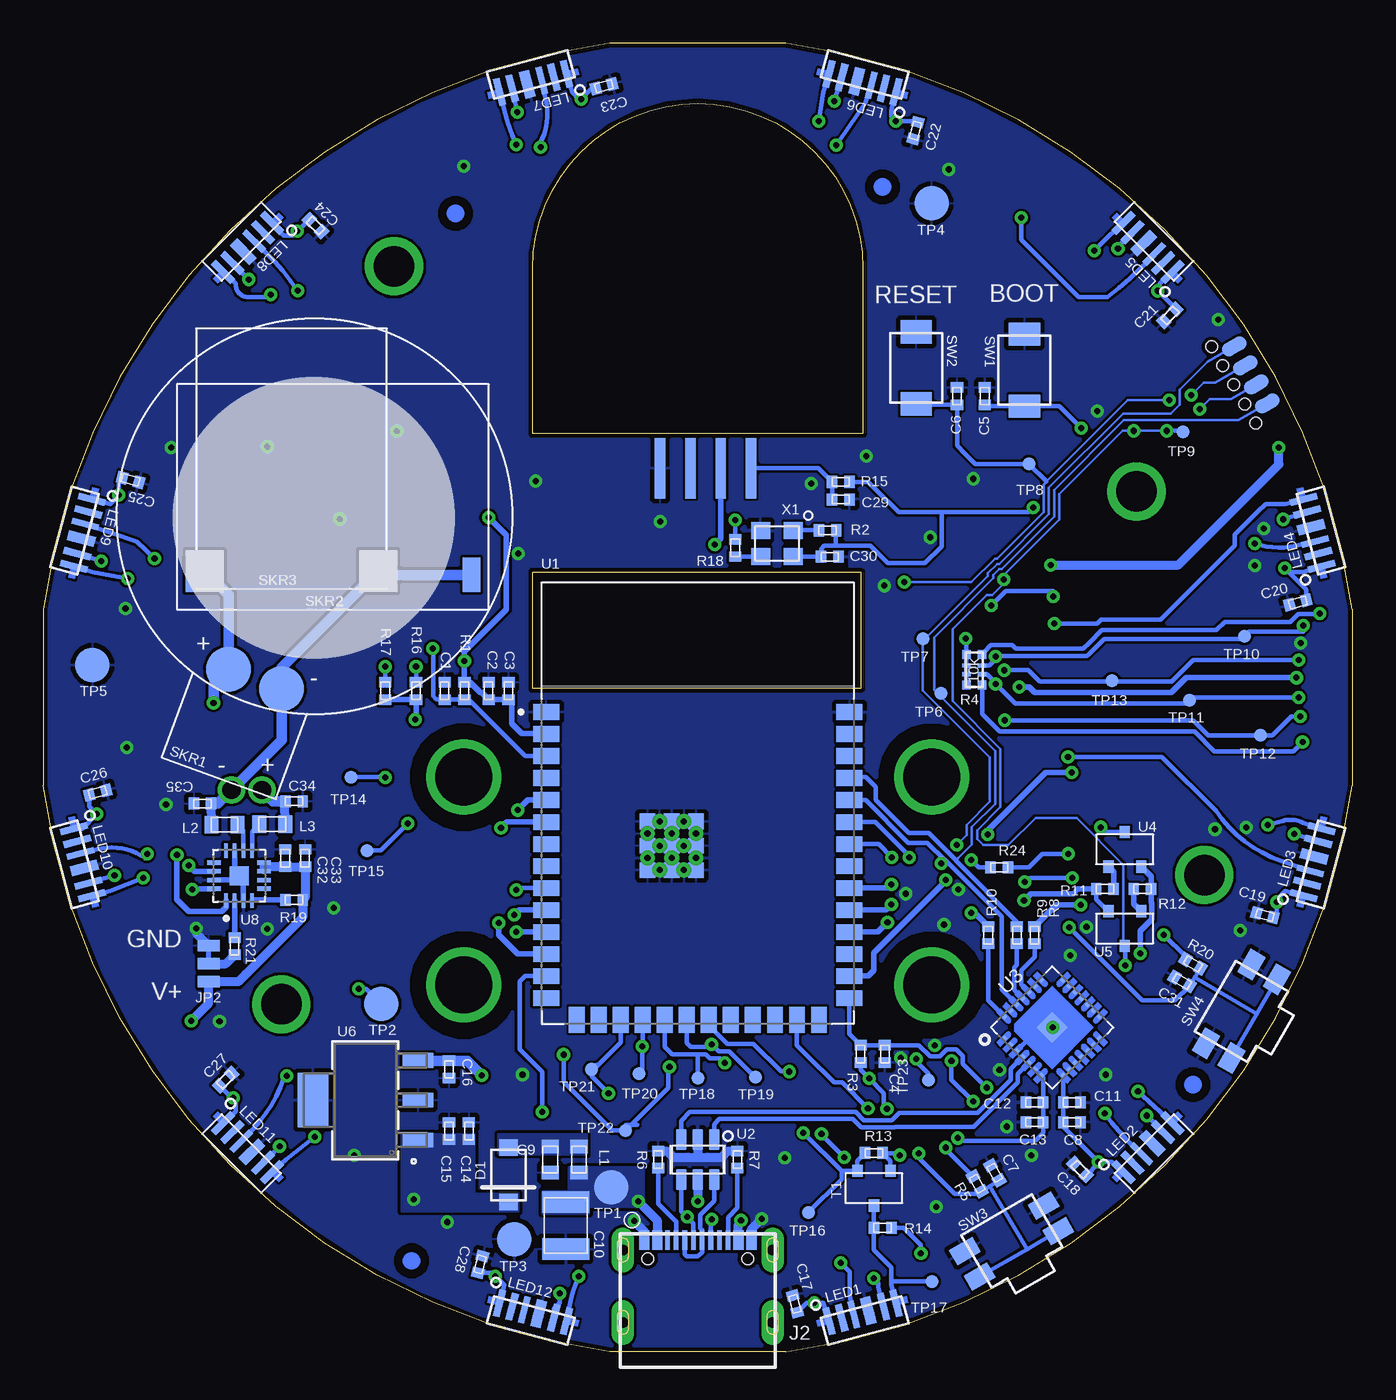
[diagram p3: board, bottom side, seen from below]

Size 75.52 x 75.52 mm. Coordinates in mm from the lower left corner, seen from the top.
Outline: 28.23,62.52 28.23,53 47.28,53 47.28,62.52 arc180 28.23,62.52
Outline: 28.36,45 28.36,38.27 47.28,38.27 47.28,45 28.36,45
Outline: 75.52,42.84 75.52,32.68 arc-75 42.84,0 32.68,0 arc-75 0,32.68 0,42.84 arc-75 32.68,75.52 42.84,75.52 arc-75 75.52,42.84
Copper layers (1*16): Top / Bottom
Stack-up Default Layer Stack: Top SilkScreen Epoxy Ink / Top SolderMask User Defined 0.0254mm Dk 4.3 / Top Surface Finish Lead-Free 0.02mm / Top CuFoil:007 0.035mm / Dielectric-1 User Defined 1.0392mm / Bottom CuFoil:007 0.035mm / Bottom Surface Finish Lead-Free 0.02mm / Bottom SolderMask User Defined 0.0254mm Dk 4.3 / Bottom SilkScreen Epoxy Ink
Design rules: minimum copper width 6mil, minimum drill size 0.35mm, copper clearance wire_polygon to wire_polygon 6mil, copper clearance wire_polygon to pad_smd 6mil, copper clearance wire_polygon to via 6mil, copper clearance pad_smd to pad_smd 6mil, copper clearance pad_smd to via 6mil, copper clearance via to via 6mil, copper clearance smd to pad (same net) 6mil, copper clearance smd to via (same net) 6mil, copper clearance smd to smd (same net) 6mil, dimension clearance 10mil, via restrict clearance 0mil, restrict clearance 0mil, drill distance 6mil, keepout clearance 0mil

### Footprints (pad centres in the part's own frame; a part is rotated, then mirrored left to right if it is on the bottom)
0402 = smd 0.7 x 0.6: P$1 0,0.5; P$2 0,-0.5
0603 = smd 1 x 0.8: P$1 0,0.75; P$2 0,-0.75
1210 = smd 2.7 x 1.25: P$1 0,1.35; P$2 0,-1.35
SOD-123FL = smd 0.95 x 1.05: P$1 -1.575,0; P$2 1.575,0
1.28ROUNDDISPLAY_STANDOFFS = smd 0.3 x 1: 1 -1.75,2.3; 2 -1.25,2.3; 3 -0.75,2.3; 4 -0.25,2.3; 5 0.25,2.3; 6 0.75,2.3; 7 1.25,2.3; 8 1.75,2.3 | drill 3.3: P$1 -13.5,1.35; P$2 13.5,1.35; P$3 13.5,-10.65; P$4 -13.5,-10.65 | smd 1.65 x 1.3: Z1 -4.025,0.4; Z2 4.025,0.4
GCT_MEM2052-00-195-00-A_REVA = smd 1.4 x 1.9: G1 -6.575,-5.925; G2 6.575,-6.925 | smd 1.2 x 1.4: G3 -5.035,7.225 | smd 1.3 x 1.4: G4 0.715,7.225 | smd 0.8 x 1.5: P1 1.905,-3.635; P2 0.805,-3.235; P3 -0.295,-3.635; P4 -1.395,-3.835; P5 -2.495,-3.635; P6 -3.595,-3.835; P7 -4.695,-3.635; P8 -5.795,-3.635 | smd 1 x 1.04: P9 -3.585,7.595
12402012E212A = smd 0.58 x 1.14: A1B12 -3.1,4.75; A4B9 -2.35,4.75; B1A12 3.1,4.75; B4A9 2.35,4.75 | smd 0.27 x 1.14: A5 -1.25,4.75; A6 -0.25,4.75; A7 0.25,4.75; A8 1.25,4.75; B5 1.75,4.75; B6 0.75,4.75; B7 -0.75,4.75; B8 -1.75,4.75 | drill 0.6 pad 1.3 long: P$13 -4.32,0; P$14 4.32,0; P$15 -4.32,4.18; P$16 4.32,4.18 | hole 0.65: -2.89,3.68; 2.89,3.68
S4B-PH-SM4-TB(LF)(SN) = smd 1.5 x 3.4: NC1 -5.35,5.75; NC2 5.35,5.75 | smd 1 x 3.5: P$1 3,0; P$2 1,0; P$3 -1,0; P$4 -3,0
SOICBITE = smd 0.8 x 1.5: 1 1.905,0.75; 2 0.635,0.75; 3 -0.635,0.75; 4 -1.905,0.75 | smd 0.8 x 1.5 bottom: 5 -1.905,0.75; 6 -0.635,0.75; 7 0.635,0.75; 8 1.905,0.75 | hole 0.65: -2.54,1.905; -1.27,1.905; 0,1.905; 1.27,1.905; 2.54,1.905
SMT-JUMPER_3_1-NC_TRACE_NO-SILK = smd 0.66 x 1.27: 1 -1.041,0; 2 0,0; 3 1.041,0
SK6805SIDE-FRGBW = smd 0.4 x 1.6: P$1 -2,0.1; P$2 -1.25,0.1; P$5 1.25,0.1; P$6 2,0.1 | smd 0.35 x 1.6: P$3 -0.525,0.1 | smd 0.6 x 1.6: P$4 0.35,0.1
RESPACK_4X0402 = smd 0.525 x 0.5: 1 -0.887,-0.45; 4 0.887,-0.45; 5 0.887,0.45; 8 -0.887,0.45 | smd 0.25 x 0.5: 2 -0.25,-0.45; 3 0.25,-0.45; 6 0.25,0.45; 7 -0.25,0.45
WIIMOTE_SPEAKER = smd 2.6 x 2.6: P$1 -1.625,-10; P$2 1.625,-10
CS18-01R80-02-1X = smd 1 x 2: P$1 -8,-4.5; P$2 8,-4.5
OWS-111535LA-8H = smd 2.2 x 2.4: P$1 -5,-6.5; P$2 5,-6.5
3X4SMD = smd 1.35 x 1.8: P$1 -2.075,0; P$2 2.075,0
EVQ-PUA02K = smd 1.55 x 1: P$1 2.625,0.85; P$2 2.625,-0.85; P$3 -2.625,0.85; P$4 -2.625,-0.85
SOT23 = smd 0.6 x 0.7: P$1 -0.95,-1; P$2 0.95,-1; P$3 0,1
HARWIN_LANDING_P25-4023 = smd 2 x 2: P$1 0,0
HARWIN_LANDING_P25-01_20MIL = smd 0.762 x 0.762: P$1 0,0
ESP32-S3-WROOM-1 = smd 1.5 x 0.9: 1 -8.75,5.26; 2 -8.75,3.99; 3 -8.75,2.72; 4 -8.75,1.45; 5 -8.75,0.18; 6 -8.75,-1.09; 7 -8.75,-2.36; 8 -8.75,-3.63; 9 -8.75,-4.9; 10 -8.75,-6.17; 11 -8.75,-7.44; 12 -8.75,-8.71; 13 -8.75,-9.98; 14 -8.75,-11.25; 27 8.75,-11.25; 28 8.75,-9.98; 29 8.75,-8.71; 30 8.75,-7.44; 31 8.75,-6.17; 32 8.75,-4.9; 33 8.75,-3.63; 34 8.75,-2.36; 35 8.75,-1.09; 36 8.75,0.18; 37 8.75,1.45; 38 8.75,2.72; 39 8.75,3.99; 40 8.75,5.26 | smd 0.9 x 1.5: 15 -6.985,-12.5; 16 -5.715,-12.5; 17 -4.445,-12.5; 18 -3.175,-12.5; 19 -1.905,-12.5; 20 -0.635,-12.5; 21 0.635,-12.5; 22 1.905,-12.5; 23 3.175,-12.5; 24 4.445,-12.5; 25 5.715,-12.5; 26 6.985,-12.5 | smd 0.9 x 0.9: 41_1 -1.5,-2.46; 41_2 -2.9,-2.46; 41_3 -0.1,-2.46; 41_4 -2.9,-3.86; 41_5 -1.5,-3.86; 41_6 -0.1,-3.86; 41_7 -2.9,-1.06; 41_8 -1.5,-1.06; 41_9 -0.1,-1.06 | drill 0.35: 41_10 -1.5,-1.76; 41_11 -2.9,-1.76; 41_12 -0.1,-1.76; 41_13 -2.9,-3.16; 41_14 -1.5,-3.16; 41_15 -0.1,-3.16; 41_16 -2.2,-1.06; 41_17 -0.8,-1.06; 41_18 -2.2,-2.46; 41_19 -0.8,-2.46; 41_20 -2.2,-3.86; 41_21 -0.8,-3.86
SOT95P280X145-6N = smd 1.2 x 0.6: 1 -1.15,0.95; 2 -1.15,0; 3 -1.15,-0.95; 4 1.15,-0.95; 5 1.15,0; 6 1.15,0.95
IC_CP2102N-A02-GQFN28R = smd 0.25 x 0.25: 1 -2.4,1.5; 2 -2.4,1; 3 -2.4,0.5; 4 -2.4,0; 5 -2.4,-0.5; 6 -2.4,-1; 7 -2.4,-1.5; 8 -1.5,-2.4; 9 -1,-2.4; 10 -0.5,-2.4; 11 0,-2.4; 12 0.5,-2.4; 13 1,-2.4; 14 1.5,-2.4; 15 2.4,-1.5; 16 2.4,-1; 17 2.4,-0.5; 18 2.4,0; 19 2.4,0.5; 20 2.4,1; 21 2.4,1.5; 22 1.5,2.4; 23 1,2.4; 24 0.5,2.4; 25 0,2.4; 26 -0.5,2.4; 27 -1,2.4; 28 -1.5,2.4 | smd 1.27 x 1.27: 29 0,0
SOT-223_DIO = smd 0.851 x 1.761: 1 -2.3,-3.025; 2 0,-3.025; 3 2.3,-3.025 | smd 3.151 x 1.761: 4 0,3.025
PIXART_CAMERA_BOARDEDGE = smd 0.6 x 3.5: P$1 3.075,-1.75; P$3 1.325,-1.75; P$5 -0.425,-1.75; P$7 -2.175,-1.75 | smd 0.6 x 3.5 bottom: P$2 2.175,-1.75; P$4 0.425,-1.75; P$6 -1.325,-1.75; P$8 -3.075,-1.75 | smd 0.8 x 3.5: P$9 -5.375,-1.75; P$10 5.375,-1.75
QFN50P300X300X80-17N = smd 0.84 x 0.27: 1 -1.435,0.75; 2 -1.435,0.25; 3 -1.435,-0.25; 4 -1.435,-0.75; 9 1.435,-0.75; 10 1.435,-0.25; 11 1.435,0.25; 12 1.435,0.75 | smd 0.27 x 0.84: 5 -0.75,-1.435; 6 -0.25,-1.435; 7 0.25,-1.435; 8 0.75,-1.435; 13 0.75,1.435; 14 0.25,1.435; 15 -0.25,1.435; 16 -0.75,1.435 | smd 1.1 x 1.1: 17 0,0
SIT8008AI-1X = smd 1.1 x 1: P$1 -0.95,-0.75; P$2 0.95,-0.75; P$3 0.95,0.75; P$4 -0.95,0.75

### Placement (x,y rotation side)
C1  52.36,38.14 180 bottom
C2  49.82,38.14 180 bottom
C3  48.68,38.14 180 bottom
C4  26.96,17.19 0 bottom
C5  21.2,55.16 0 bottom
C6  22.8,55.16 0 bottom
C7  20.61,10.33 30 bottom
C8  16.17,13.25 90 bottom
C9  46.27,11.09 0 bottom
C10  45.38,7.28 0 bottom
C11  16.17,14.39 90 bottom
C12  18.33,14.39 270 bottom
C13  18.33,13.25 270 bottom
C14  50.97,12.74 180 bottom
C15  52.11,12.74 180 bottom
C16  52.11,16.3 0 bottom
C17  32.15,2.76 15 bottom
C18  15.7,10.52 45 bottom
C19  5.04,25.2 75 bottom
C20  3.14,43.24 105 bottom
C21  10.52,59.82 135 bottom
C22  25.2,70.48 165 bottom
C23  43.17,73.04 285 bottom
C24  59.82,65 225 bottom
C25  70.48,50.32 255 bottom
C26  72.38,32.28 285 bottom
C27  65,15.7 315 bottom
C28  50.32,5.04 345 bottom
C29  29.5,49.19 90 bottom
C30  30.14,45.89 270 bottom
C31  9.82,21.38 60 bottom
C32  61.56,28.49 180 bottom
C33  60.42,28.49 180 bottom
C34  61.05,31.77 90 bottom
C35  66.33,31.64 270 bottom
D1  48.68,10.2 90 bottom
DISP1  37.76,22.52 180 top
J1  8.58,37.48 270 top
J2  37.76,1.69 0 bottom
J4  16.3,58.71 270 top
JP1  5.2,56.76 240 top
JP2  65.98,22.39 90 bottom
L1  44.62,11.09 0 bottom
L2  65.06,30.42 270 bottom
L3  62.32,30.44 90 bottom
LED1  28.23,2.18 15 bottom
LED2  11.72,11.72 45 bottom
LED3  2.18,28.23 75 bottom
LED4  2.18,47.29 105 bottom
LED5  11.72,63.8 135 bottom
LED6  28.23,73.33 165 bottom
LED7  47.29,73.33 195 bottom
LED8  63.8,63.8 225 bottom
LED9  73.33,47.29 255 bottom
LED10  73.33,28.23 285 bottom
LED11  63.8,11.72 315 bottom
LED12  47.29,2.18 345 bottom
R1  51.22,38.14 180 bottom
R2  30.27,47.41 90 bottom
R3  28.36,17.19 0 bottom
R4  21.81,39.36 90 bottom
R5  21.63,9.69 210 bottom
R6  40.05,11.09 180 bottom
R7  35.47,11.09 180 bottom
R8  18.33,24.04 0 bottom
R9  19.34,24.04 0 bottom
R10  21,24.04 0 bottom
R11  14.26,26.71 90 bottom
R12  12.11,26.71 270 bottom
R13  27.6,11.47 90 bottom
R14  27.09,7.15 90 bottom
R15  29.5,50.21 90 bottom
R16  54.02,38.14 180 bottom
R17  55.79,38.14 180 bottom
R18  35.6,46.4 180 bottom
R19  61.05,26.08 270 bottom
R20  9.18,22.39 240 bottom
R21  64.48,23.41 0 bottom
R22  32.55,19.6 270 top
R23  30.77,15.66 270 top
R24  20.36,27.96 270 bottom
SKR1  59.88,48.22 340 bottom
SKR2  58.82,49.34 0 bottom
SKR3  61.2,51.55 0 bottom
SW1  18.91,56.66 270 bottom
SW2  25.16,56.78 270 bottom
SW3  19.65,6.39 30 bottom
SW4  6.39,19.65 60 bottom
T1  27.6,9.44 180 bottom
T2  30.77,17.95 0 top
TP1  42.74,9.49 180 bottom
TP2  56.02,20.08 180 bottom
TP3  48.35,6.49 180 bottom
TP4  24.27,66.28 180 bottom
TP5  72.68,39.64 180 bottom
TP6  23.71,38.01 180 bottom
TP7  24.76,41.14 180 bottom
TP8  18.66,51.25 180 bottom
TP9  9.77,53.1 180 bottom
TP10  6.21,41.29 180 bottom
TP11  9.39,37.61 180 bottom
TP12  5.3,35.58 180 bottom
TP13  13.86,38.73 180 bottom
TP14  57.78,33.16 180 bottom
TP15  56.84,28.92 180 bottom
TP16  31.38,8.04 180 bottom
TP17  24.25,4.05 180 bottom
TP18  37.76,15.79 90 bottom
TP19  34.43,15.84 90 bottom
TP20  41.16,16.04 90 bottom
TP21  43.88,16.3 90 bottom
TP22  41.93,12.77 90 bottom
TP23  24.45,15.69 90 bottom
U1  37.76,31.66 0 bottom
U2  37.76,11.09 270 bottom
U3  17.31,18.71 45 bottom
U4  13.12,29 0 bottom
U5  13.12,24.42 180 bottom
U6  56.94,14.52 90 bottom
U7  37.76,52.74 0 top
U8  64.23,27.47 90 bottom
U$1  [LOGO]  54.3,43.96 0 top
U$2  [FIDUCIAL]  51.73,65.7 0 top
U$3  [FIDUCIAL]  27.09,67.22 0 top
U$4  [FIDUCIAL]  37.76,1.69 0 top
U$5  [FIDUCIAL]  54.27,5.25 180 bottom
U$6  [FIDUCIAL]  51.73,65.7 180 bottom
U$7  [FIDUCIAL]  27.09,67.22 180 bottom
U$8  [FIDUCIAL]  9.18,15.41 180 bottom
U$9  [FIDUCIAL]  9.18,15.41 0 top
X1  33.19,46.65 180 bottom

### Tracks (layer width: path | path; a pad name or v marks a point on that pad's centre or on a via)
3V3  (via drill 0.35)
  Top 0.254: 46.33,12.22 46.33,12.19 | 26.15,10.28 26.1,10.33 v26.1,11.35 | 19.24,42.99 19.37,42.99 19.65,42.99 19.83,42.81 20.49,42.15 21.2,41.44 21.48,41.16 v22.29,41.16 | DISP1.7 36.51,18.53 32.43,14.44 30.14,14.44 28.81,15.78 v27.87,15.78 | v26.84,14.01 27.05,14.01 27.69,13.38 28.84,13.38 29.4,12.82 30.37,12.82 v30.62,12.57 | v29.3,11.22 29.3,10.28
  Top 0.305: v3.22,38.9 3.24,38.88 J1.P4 | v54.07,36.49 51.22,39.33 v51.22,39.87
  Top 0.508: U7.P$1 40.83,48.53 41.21,48.15 v49.82,48.15 52.75,51.07
  Top 0.61: 50.15,16.02 46.33,12.19 44.41,10.28 34.97,10.28 29.3,10.28 26.15,10.28 24.95,10.28 v23.44,11.78 22.76,12.47 | J4.P$1 16.75,55.26 16.75,50.4 16.76,50.39 18.35,48.8 | 18.35,48.8 18.35,48.71 v18.41,48.71 | 50.15,16.02 52.4,16.02 v57.32,20.94 59.05,22.67 63.75,22.67 66.34,25.26 66.68,25.26 67.75,26.34 67.75,27.43 68.64,28.32 68.64,30.24 69.85,31.45 69.85,40.8 59.58,51.07 52.75,51.07 | 10.84,24.09 v10.86,24.06 | 10.84,24.09 12.84,26.1 13.73,26.1 v16.37,28.74 16.45,28.74 | 10.84,24.09 10.84,22.16 17.98,15.02 20.13,15.02 21.53,13.62 21.6,13.62 22.76,12.47 | v16.38,28.74 16.45,28.74 | v16.38,28.74 | v16.38,28.74 | 22.76,12.47 | v50.22,15.95 50.15,16.02 | 16.45,28.74 19.22,31.51 19.22,37.36 v19.22,38.35 v19.22,38.36 19.22,39.04 19.24,39.06 19.24,42.99 19.24,43.69 19.14,43.8 18.74,44.19 18.74,44.2 18.35,44.59 18.35,48.8 | 22.76,12.47 v22.76,12.33
  Bottom 0.254: T1.P$1 26.65,11.02 R13.P$2 27.07,11.45 26.2,11.45 v26.1,11.35 | R15.P$2 27.93,50.21 27.52,49.8 26.18,48.45 24.78,48.45 23.69,48.45 | X1.P$4 32.23,45.89 C30.P$2 30.64,46.33 30.45,46.52 29.81,46.52 | 23.69,48.45 23.69,46.47 24.65,45.51 26.79,45.51 27.8,46.52 29.81,46.52 | R5.P$2 23.44,11.69 v23.44,11.78 | R20.P$2 9.62,22.82 v10.86,24.06 | 28.36,16.58 R3.P$2 28.36,16.27 v27.87,15.78 27.02,14.92 27.02,14.19 v26.84,14.01 | U3.6 U3.7 17.83,15.83 C12.P$1 C13.P$1 17.83,12.63 18.2,12.26 18.28,12.18 22.47,12.18 22.62,12.33 v22.76,12.33 | v16.38,28.74 17.87,28.74 18.66,27.96 R24.P$1 | v30.62,12.57 30.62,12.54 v29.3,11.22 | TP2.P$1 56.88,20.94 v57.32,20.94 | 23.69,48.45 18.67,48.45 v18.41,48.71 | R2.P$2 29.81,47.37 29.81,46.52 | R4.8 R4.7 R4.6 R4.5 22.26,41.13 v22.29,41.16
  Bottom 0.305: U1.2 46.53,35.68 47.91,35.68 48.5,36.27 48.5,37.46 C3.P$1 C2.P$1 50.22,38.04 50.3,38.04 50.91,38.64 R1.P$2 v51.22,39.87 51.22,40.43 50.26,41.39 48.81,42.84 48.81,47.13 v49.82,48.15 | R17.P$1 R16.P$1 54.02,36.54 v54.07,36.49 | v3.22,38.9 9.58,38.9 10.45,38.04 18.32,38.04 18.63,38.36 v19.22,38.36
  Bottom 0.61: U6.3 53.89,16.8 C16.P$1 51.07,16.8 v50.22,15.95
BACKLIGHT  (via drill 0.35)
  Top 0.254: DISP1.1 39.51,20.9 39.44,20.97 39.28,21.12 37.68,21.12 34.58,21.12 33.92,20.46 33.06,20.46 | 33.06,20.46 32.32,20.46 28.41,20.46 25.27,17.32 25.27,17.02 v25.15,16.9 | R22.P$1 33.05,20.45 33.06,20.46
  Bottom 0.254: TP23.P$1 24.45,16.07 25.15,16.77 v25.15,16.9
BACKLIGHT_PWM  (via drill 0.35)
  Top 0.254: T2.P$1 29.82,16.11 R23.P$2 30.27,15.07 30.39,14.95 30.5,14.85 31.89,14.85 32.48,15.43 v32.48,16.17
  Bottom 0.254: U1.21 37.12,18.84 36.05,17.77 34.55,17.77 32.95,16.17 v32.48,16.17
BCLK  (via drill 0.35)
  Top 0.305: v26.81,24.78 27.37,25.34 44.01,25.34 46.29,27.62 46.49,27.83 58.97,27.83 65.78,27.83 v66.92,26.69
  Bottom 0.305: U1.30 27.37,24.22 v26.81,24.78 | U8.16 65.67,26.71 66.89,26.71 v66.92,26.69
BUTTON  (via drill 0.35)
  Top 0.254: v26.56,28.54 26.51,28.54 23.6,25.62 23.2,25.62 20.03,22.45 20.03,20.6 23.12,17.51 v23.12,16.79 | v21.87,14.46 22,14.46 v25.01,11.45
  Bottom 0.254: SW3.P$2 18.76,5.92 | 18.76,5.92 SW3.P$4 | C7.P$2 20.91,9.55 | 20.91,9.55 R5.P$1 21.53,9.11 22.93,9.11 25.01,11.19 v25.01,11.45 | 20.91,9.55 18.76,5.92 | U1.34 27.32,29.3 v26.56,28.54 | v23.12,16.79 23.12,15.7 v21.87,14.46
BUTTON2  (via drill 0.35)
  Top 0.254: v16.16,27.35 16.37,27.13 16.37,24.55 v16.32,24.5 | v18.88,27.12 19.97,26.03 23.19,26.03 25.56,28.4 v25.56,28.52
  Bottom 0.254: 5.49,19.51 SW4.P$2 | 5.49,19.51 SW4.P$4 | R20.P$1 9.08,21.62 | 9.08,21.62 C31.P$2 10.23,20.28 12.11,20.28 v16.32,24.5 | 9.08,21.62 5.49,19.51 | U1.35 27.53,30.57 25.62,28.67 25.62,28.57 v25.56,28.52 | v16.16,27.35 18.57,27.35 18.8,27.12 v18.88,27.12
CLK  (via drill 0.35)
  Top 0.254: U7.P$7 35.6,50.98 v35.6,48
  Bottom 0.254: R18.P$2 v35.6,48
CS  (via drill 0.35)
  Top 0.254: v40.97,17.63 39.01,19.59 DISP1.2
  Bottom 0.254: U1.18 40.93,17.63 | TP20.P$1 40.97,16.23 v40.97,17.63
  Bottom 0.305: 40.93,17.63 v40.97,17.63
DC  (via drill 0.35)
  Top 0.254: DISP1.3 38.58,20.15 38.58,19.28 39.23,18.63 39.23,18.32 42.63,14.92 v42.91,14.92
  Bottom 0.254: 43.63,16.55 TP21.P$1 | U1.17 42.2,17.85 42.84,17.21 43.75,16.3 TP21.P$1 | v42.91,14.92 43.88,15.89 TP21.P$1
DTR  (via drill 0.35)
  Top 0.305: v18.93,26.05 19.25,26.05 19.75,25.56 21.76,25.56 v21.98,25.33
  Bottom 0.254: U5.P$2 14.76,26.12 R11.P$1
  Bottom 0.305: R11.P$1 15.83,26.71 16.1,26.43 18.55,26.43 v18.93,26.05 | v21.98,25.33 21.78,25.33 R10.P$1
EN  (via drill 0.35)
  Top 0.152: v10.55,54.92 10.25,55.22 v9.29,55.22
  Top 0.254: v20.84,43.06 21.76,43.99 25.42,43.99 v25.85,44.41 26.76,45.33 26.81,45.38 49.65,45.38 53.05,41.98 v53.05,40.58 | v14.51,30.27 14.62,30.17 15.64,30.17 17.85,32.37 17.85,42.98 v17.24,43.58
  Bottom 0.152: v9.29,55.22 8.57,55.95 7.89,55.95 JP1.6 | v10.55,54.92 12.94,54.92 17.65,50.21 17.8,50.06 17.8,48.46 20.49,45.78 20.61,45.78 21.97,44.41 v25.85,44.41
  Bottom 0.254: U1.3 47.72,34.38 49.06,35.73 50.98,37.64 R1.P$1 C1.P$1 52.83,37.64 52.9,37.71 53.02,37.84 53.02,40.55 v53.05,40.58 | v20.84,43.06 19.99,43.91 17.24,43.91 v17.24,43.58 | U4.P$3 14.24,30 v14.51,30.27 | SW2.P$2 25.11,54.66 C6.P$2 22.8,52.29 22.34,51.83 21.76,51.25 TP8.P$1 17.65,50.24 17.65,50.21
  Bottom 0.305: 52.36,37.51 C1.P$1
GND  (via drill 0.35)
  Top 0.254: J1.G2 5.74,31.22 5.81,31.16 6.1,30.86 v6.1,30.25 | v5.63,45.38 5.17,45.38 4.66,44.87 3.85,44.06 J1.G1
  Top 0.305: v2.96,40.91 2.96,40.97 4.64,40.97 J1.P6
  Top 0.508: JP1.4 v7.74,59.58
  Bottom 0.254: 39.31,27.8 U1.41_5 U1.41_21 U1.41_6 U1.41_15 U1.41_3 | 39.31,27.8 U1.41_20 U1.41_4 U1.41_13 U1.41_2 | U1.41_2 U1.41_11 U1.41_7 U1.41_16 39.28,30.6 | 39.28,30.6 U1.41_8 U1.41_17 | U1.41_17 U1.41_9 | U1.41_17 U1.41_12 U1.41_3 | U1.41_3 U1.41_19 U1.41_1 | U1.41_1 U1.41_10 39.26,30.58 39.28,30.6 | U1.41_2 U1.41_18 U1.41_1 | U1.41_1 U1.41_14 39.31,28.45 39.31,27.8 | U3.29 v17.29,18.71 17.29,19.44 U3.3 | v2.96,40.91 3.03,40.91
  Bottom 0.305: U8.3 63.98,27.22 U8.17 | U8.15 64.48,27.22 U8.17 | U8.11 64.48,27.72 U8.17
  Bottom 0.508: J2.A1B12 40.86,6.95 41.43,7.52 v41.43,7.54 | J2.B1A12 34.66,7.08 v34.08,7.66 | U2.2 37.76,11.27 37.81,11.22 | 37.81,11.22 37.84,11.19 37.79,11.23 36.39,11.23 36.03,11.59 R7.P$2 | 37.81,11.22 39.18,11.22 39.55,11.59 R6.P$2 | JP2.3 66.69,24.14 v66.69,24.43
  other vias: 24.35,47.01 26.99,44.21 47.11,50.26 21.86,50.38 62.6,52.24 58.41,48.07 55.13,53.13 5.1,47.51 23.99,8.37 18.51,11.34 14.21,15.99 19.93,12.99 6.45,24.32 31.21,50.1 28.03,51.7 7.92,30.16 39.92,47.91 58.77,25.62 57.57,11.34 65.36,19.06 52.22,7.48 70.78,42.89 70.7,34.87 68.14,52.19 51.27,68.42 23.28,68.24 48.12,46.07 20.35,16.26 25.77,26.44 47.87,15.99 26.05,16.96 32.75,11.2 16.27,22.88 15.33,24.53 23.55,24.65 14.7,54.3 62.6,24.4 68.44,31.59 22.72,26.69 24.08,17.69
  pour Bottom (rank 4): -2.88,84.5 -2.88,-11.9 83.61,-11.9 83.61,84.5
  pour Top (rank 2): 13.69,13.69 arc90 61.83,13.69 arc90 61.83,61.83 arc90 13.69,61.83 arc90
I2S  (via drill 0.35)
  Top 0.305: v26.58,26.96 27.29,26.25 43.63,26.25 45.91,28.54 46.14,28.77 59.15,28.77 67.71,28.77 v67.81,28.67
  Bottom 0.305: U1.32 26.78,26.76 v26.58,26.96 | U8.1 64.98,25.68 65.23,25.43 67.13,25.43 67.81,26.1 v67.81,28.67
IO0  (via drill 0.35)
  Top 0.152: v10.71,53.15 9.45,54.41 v8.79,54.41
  Top 0.254: v13.1,22.29 13.12,22.27 13.12,20.88 18.4,15.6 20.72,15.6 v21.08,15.24 | 20.15,44.36 20.1,44.41 v20.1,44.56 | v15.64,53.3 12.77,53.3 v12.61,53.15
  Bottom 0.152: v8.79,54.41 8.21,54.98 7.01,54.98 JP1.7 | U5.P$3 13.2,23.5 13.2,28.1 15.9,30.8 18.27,30.8 19.83,29.24 21.28,29.24 21.64,29.59 21.64,30.1 20.3,31.44 20.3,34.8 23.04,37.55 23.04,41.71 21.09,43.67 20.78,43.67 20.08,44.36 | 20.08,44.36 20.08,44.84 16.89,48.03 16.89,49.51 13.25,53.15 v12.61,53.15 v10.71,53.15 | 20.08,44.36 20.08,44.39 20.1,44.41 v20.1,44.56
  Bottom 0.254: U1.27 29.01,18.33 R3.P$1 C4.P$1 25,17.69 24.35,17.03 23.81,17.03 23.39,17.45 22.85,17.45 22.46,17.06 22.46,16.62 v21.08,15.24 | v13.1,22.29 13.1,23.4 U5.P$3 | TP9.P$1 9.82,53.15 v10.71,53.15 | C5.P$2 21.12,54.58 SW1.P$2 16.91,54.58 v15.64,53.3
LED  (via drill 0.35)
  Top 0.254: v31.66,12.64 31.08,13.22 29.57,13.22 28.74,14.05 v27.94,14.05
  Bottom 0.254: R13.P$1 28.55,11.02 T1.P$2 29.46,10.44 | U1.25 32.04,17.69 31.46,17.11 29.89,15.53 29.42,15.53 v27.94,14.05 | v31.66,12.64 29.46,10.44 | TP16.P$1 29.46,9.96 29.46,10.44
LED_SHIFTED
  Bottom 0.254: LED1.P$6 26.58,3.85 26.58,3.95 | 26.58,3.95 26.58,4.87 27.09,5.37 27.59,5.87 R14.P$1 T1.P$3 | TP17.P$1 26.48,4.05 26.58,3.95
LRCLK  (via drill 0.35)
  Top 0.305: v26.58,25.82 27.08,25.82 27.11,25.8 43.82,25.8 46.1,28.08 46.31,28.29 59.07,28.29 66.89,28.29 v67.12,28.06
  Bottom 0.305: U1.31 26.91,25.49 v26.58,25.82 | v67.12,28.06 66.79,27.72 U8.14
MOSI  (via drill 0.35)
  Top 0.254: DISP1.5 37.51,18.13 37.62,18.02 37.62,17.48 37.24,17.09 36.61,17.09 v36.19,16.67
  Bottom 0.254: U1.19 39.66,17.59 39.23,17.16 37.76,17.16 | 37.76,17.16 37.31,17.16 37.08,16.93 36.45,16.93 v36.19,16.67 | TP18.P$1 37.76,17.16
N$1
  Bottom 0.254: X1.P$3 R18.P$1
N$2  (via drill 0.35)
  Top 0.254: v36.95,7.64 38.2,7.64 v38.36,7.8
  Bottom 0.254: U2.4 38.71,8.1 38.39,7.79 | 38.39,7.79 38.01,7.41 38.01,7.4 J2.A6 | J2.B6 37,6.45 37,7.59 v36.95,7.64 | 38.39,7.79 38.37,7.79 v38.36,7.8
N$3  (via drill 0.35)
  Top 0.305: v1.87,42.61 2.87,42.61 3.31,43.05 4.72,43.05 J1.P8
  Bottom 0.254: v1.87,42.61 1.97,42.61 2,42.58 3.11,42.58 3.56,42.13 7.36,42.13 7.84,41.65 13.48,41.65 14.44,41.65 15.15,40.93 15.51,40.58 19.41,40.58 19.61,40.78 20.85,40.78 21.24,40.39 21.24,40.37 R4.4
N$4  (via drill 0.35)
  Top 0.305: J1.P1 3.24,35.58 v2.86,35.2
  Bottom 0.254: v2.86,35.2 3.41,34.65 7.95,34.65 9.08,35.79 20.33,35.79 21.36,36.82 R4.1
N$5
  pour Bottom (no thermals): 44.11,11.34 49.32,11.34 49.32,12.61 44.11,12.61
N$6
  Bottom 0.254: J2.B7 38.51,5.62 38.39,5.5 37.76,5.5 37.51,5.75 J2.A7 37.51,7.04 37.6,7.14 37.6,7.91 36.81,8.7 U2.6
N$7
  Bottom 0.254: R6.P$1 40.05,8.55 39.03,7.53 39.01,7.51 J2.A5
N$8
  Bottom 0.254: R7.P$1 35.47,8.3 36.01,7.77 J2.B5
N$9
  Bottom 0.305: R11.P$2 13.76,27.69 U4.P$1
N$10
  Bottom 0.305: U5.P$1 12.61,25.86 R12.P$2
N$13  (via drill 0.35)
  Top 0.254: v29.5,5.12 19.6,8.93 arc-38 v12.36,15.03
  Bottom 0.254: LED1.P$3 29,3.22 29,4.61 v29.5,5.12 | LED2.P$6 11.09,13.88 v12.36,15.03
N$14  (via drill 0.35)
  Top 0.254: v14.26,13.76 11.98,16.68 arc-21 v4.87,30.39
  Bottom 0.254: LED2.P$3 12.99,12.23 arc12 v14.26,13.76 | LED3.P$6 2.83,30.52 arc-45 3.98,30.65 v4.87,30.39
N$15  (via drill 0.35)
  Top 0.254: v16.4,34.34 16.67,34.34 17.27,34.94 17.27,41.94 v17.19,42.02
  Bottom 0.254: LED3.P$3 4.09,28.32 arc37 7.86,31.2 10.99,34.34 v16.4,34.34 | LED4.P$6 3.85,48.94 4.99,48.94 5.45,48.48 6.77,47.16 6.77,46.52 11.04,42.26 14.49,42.26 14.72,42.02 v17.19,42.02
N$16
  Bottom 0.254: U3.24 19.09,21.19 19.09,21.63 19.09,22.01 18.84,22.27 18.33,22.77 R8.P$2
N$17
  Bottom 0.254: U3.25 19.5,20.89 19.5,22.18 19.34,22.33 R9.P$2
N$18  (via drill 0.35)
  Top 0.254: v5.63,46.65 6.01,48.68 arc-42 13.91,61.42 arc-42 13.91,62.58 arc-42 v14.88,63.55
  Bottom 0.254: LED4.P$3 3.22,46.52 arc31 v5.63,46.65 | LED5.P$6 14.01,64.43 arc-68 14.01,64.41 v14.88,63.55
N$19  (via drill 0.35)
  Top 0.254: v19.09,65.45 v30.77,71.03
  Bottom 0.254: LED5.P$3 12.23,62.52 arc10 14.14,60.87 15.79,60.87 19.09,64.18 v19.09,65.45 | LED6.P$6 30.52,72.68 v30.77,71.03
N$20
  Bottom 0.254: U3.28 21,20.27 R10.P$2
N$21  (via drill 0.35)
  Top 0.254: v29.76,69.64 31.79,70.78 arc-29 38.39,72.56 arc-36 48.17,69.51 arc-36 48.17,69.6 arc-36 v48.24,69.67
  Bottom 0.254: LED6.P$3 28.11,72.05 v29.76,69.64 | LED7.P$6 48.94,71.67 arc-11 48.17,69.51 arc-11 48.17,69.6 arc-11 v48.24,69.67
N$22  (via drill 0.35)
  Top 0.254: v69.1,45.79 69.1,44.9 70.45,40.87 arc-43 v69.76,27.35
  Bottom 0.254: LED9.P$3 70.12,46.75 v69.1,45.79 | LED10.P$6 71.67,26.58 v69.76,27.35
N$23  (via drill 0.35)
  Top 0.254: v70.65,44.62 63.79,60.37 arc-1 61.88,60.35 61.78,60.35 60.9,61.23 v60.84,61.23
  Bottom 0.254: LED8.P$3 62.65,63.41 arc13 60.87,61.25 arc13 60.85,61.23 arc13 v60.84,61.23 | LED9.P$6 72.68,45 v70.65,44.62
N$24  (via drill 0.35)
  Top 0.254: v46.83,69.52 47.88,69.07 47.89,69.07 47.9,69.07 57.06,65.19 arc-37 61.97,60.88 62.05,60.96 arc-37 62.35,60.96 v62.4,61.01
  Bottom 0.254: LED7.P$3 46.52,72.3 arc41 46.9,69.64 arc-119 v46.83,69.52 | LED8.P$6 64.43,61.64 arc-81 63.79,60.87 62.53,60.87 v62.4,61.01
N$25  (via drill 0.35)
  Top 0.254: v61.47,15.91 53.25,9.18 arc-20 v44.62,4.36
  Bottom 0.254: LED11.P$3 63.41,12.87 arc-26 61.64,15.79 arc70 v61.47,15.91 | LED12.P$6 45.13,2.83 arc15 v44.62,4.36
N$26  (via drill 0.35)
  Top 0.254: v59.86,12.41 arc-78 59.86,12.61 arc15 68.75,26.96 69.47,28.55 69.47,28.66 v69.53,28.72
  Bottom 0.254: LED10.P$3 72.43,29 arc49 69.64,28.49 arc-109 69.47,28.55 arc-109 69.47,28.66 arc-109 v69.53,28.72 | LED11.P$6 61.51,11.09 v59.86,12.41
N$27  (via drill 2.34)
  other vias: 61.79,20.06
N$28
  Bottom 0.254: U7.P$8 30.79,50.99 R15.P$1 C29.P$1
N$29  (via drill 2.34)
  other vias: 55.29,62.65
N$30  (via drill 2.34)
  other vias: 12.45,49.66
N$31  (via drill 2.34)
  other vias: 8.54,27.52
N$32
  Bottom 0.254: R2.P$1 32.23,47.41 X1.P$1
N$34
  Bottom 0.508: JP2.2 65,22.39 R21.P$2
N$36
  Bottom 0.305: R19.P$2 63.44,26.08 U8.4
N$37
  Top 0.254: T2.P$3 31.43,19.6 R22.P$2
N$41
  Bottom 0.254: U8.10 63.98,30.08 L2.P$1
N$42
  Bottom 0.254: U8.9 63.48,30.04 L3.P$1
N$43
  Bottom 0.305: R21.P$1 U8.2
OUT+  (via drill 0.35, 1.05)
  Top 0.61: v62.9,32.42 63.41,32.93 63.41,32.94 65.7,35.23 v65.7,37.45
  Bottom 0.508: L3.P$2 61.58,31.73
  Bottom 0.61: 61.58,31.73 C34.P$1 62.24,31.77 v62.9,32.42 | v65.7,37.45 65.7,38.51 SKR1.P$1 64.83,43.68 SKR3.P$1 66.61,45.05 SKR2.P$1
OUT-  (via drill 1.05)
  Bottom 0.508: L2.P$2 C35.P$1
  Bottom 0.61: C35.P$1 65.45,31.64 v64.66,32.43 61.78,35.31 SKR1.P$2 61.78,39.48 SKR3.P$2 55.99,44.84 SKR2.P$2
RESET  (via drill 0.35)
  Top 0.254: v49.24,24.75 49.24,26.69 48.59,27.34 47.22,27.34 45.94,26.05 45.94,17.58 v45.5,17.15 | DISP1.4 38.01,18.21 38.03,18.19 38.03,17.92 39.39,16.56 v39.39,16.44
  Bottom 0.254: TP22.P$1 41.93,13.09 41.26,13.09 | v39.39,16.44 39.45,16.37 39.45,15.24 TP22.P$1 | v45.5,17.15 45.5,15.58 43.94,14.01 42.69,12.77 TP22.P$1
  Bottom 0.305: U1.12 48.15,22.95 49.24,24.04 v49.24,24.75
RTS  (via drill 0.35)
  Top 0.305: v12.23,22.99 15.04,25.8 v15.66,25.8
  Bottom 0.305: R8.P$1 17.08,25.8 v15.66,25.8 | U4.P$2 11.61,27.43 R12.P$1 11.61,25.94 11.57,25.9 11.57,24.95 12.22,24.3 12.22,23 v12.23,22.99
RX  (via drill 0.35)
  Top 0.152: v23.7,28.19 22.92,28.97 22.92,29.15 v22.81,29.26
  Bottom 0.152: v22.81,29.26 22.25,29.82 22.25,30.41 20.91,31.75 20.91,34.31 24.76,38.17 24.76,41.02 24.74,41.05 21.01,44.77 21.01,44.94 20.48,45.48 20.36,45.48 17.5,48.34 17.5,49.86 13.22,54.14 10.48,54.14 9.94,54.67 9.94,55.54 8.35,57.14 JP1.5
  Bottom 0.254: U1.36 28.07,31.84 25.61,29.38 24.51,29.38 23.49,28.36 | U3.26 20.23,20.92 20.23,25.13 23.47,28.37 23.49,28.36 | TP7.P$1 24.75,41.06 24.74,41.05 | 23.49,28.36 23.58,28.27 23.66,28.19 v23.7,28.19
SCK/SCL  (via drill 0.35)
  Top 0.305: J4.P$3 21.82,59.71 26.33,55.21 26.33,49.21 28.28,47.26 37.32,47.26 37.36,47.23 | U7.P$5 37.26,50.92 37.26,47.23 37.36,47.23 | 37.36,47.23 37.61,46.97 40.46,46.97 40.89,47.41 49.12,47.41 55.79,40.73 v55.79,39.54 v55.79,33.14 55.79,30.82 54.19,29.23 48.96,29.23 48.15,30.04 v48.15,31.26
  Bottom 0.254: R17.P$2 v55.79,39.54 | TP14.P$1 55.82,33.16 v55.79,33.14
  Bottom 0.305: v48.15,31.26 47.56,31.84 U1.5
SCLK  (via drill 0.35)
  Top 0.254: DISP1.6 37.01,18.14 36.96,18.09 v36.96,17.75
  Bottom 0.254: 38.5,19.06 U1.20 38.39,17.82 38.17,17.59 37.12,17.59 v36.96,17.75 36.55,17.34 35.96,17.34 35.93,17.34 TP19.P$1
SD_CS  (via drill 0.35)
  Top 0.254: v46.73,13.85 46.38,13.85 45.37,12.84 33.46,12.84 32.09,11.47 30.21,11.47 29.68,12 25.38,12 22.47,14.91 22.34,14.91 21.24,16.01 21.24,17.09 16.98,21.35 16.98,28.41 19.02,30.45 19.02,30.48 19.8,31.27 19.8,36.2 v20.05,36.45
  Top 0.305: v2.99,36.67 v2.99,36.68 J1.P2
  Bottom 0.254: TP12.P$1 | U1.13 47.71,21.68 47.84,21.55 48.03,21.37 48.03,17.46 46.73,16.16 v46.73,13.85 | TP12.P$1 8.3,35.58 9.17,36.45 v20.05,36.45 | TP12.P$1 4.61,35.58 3.52,36.67 v2.99,36.67
SD_MISO  (via drill 0.35)
  Top 0.254: 47.85,26.66 46.34,25.16 46.34,15.81 44.62,14.09 43.73,14.09 32.64,14.09 32.59,14.04 29.97,14.04 28.89,15.12 26.09,15.12 25.24,14.26 24.84,14.26 22.98,16.13 22.85,16.13 22.46,16.52 22.46,17.59 18.23,21.83 18.23,27.75 20.28,29.81 20.28,30.03 21.02,30.76 21.02,35.33 21.52,35.84 21.52,38.82 20.58,39.76 v20.58,40.12
  Top 0.305: v2.83,41.93 3.08,42.18 J1.P7 | v48.23,26.66 47.85,26.66
  Bottom 0.254: U1.9 48.13,26.76 v48.23,26.66 | v2.83,41.93 2.83,41.57 5.94,41.57 TP10.P$1 6.37,41.14 6.95,41.14 9.24,41.14 14.31,41.14 15.15,40.3 15.3,40.15 20.38,40.15 20.55,39.98 | R4.3 20.94,39.61 20.57,39.98 20.55,39.98 | 20.55,39.98 20.56,39.99 20.56,40.1 v20.58,40.12
SD_MOSI  (via drill 0.35)
  Top 0.254: v3.09,37.76 3.1,37.78 J1.P3 | v48.34,25.21 47.71,25.21 46.78,24.27 46.78,15.61 44.82,13.65 33.12,13.65 33.1,13.63 29.74,13.63 28.66,14.71 26.3,14.71 25.4,13.81 24.73,13.81 22.81,15.73 22.68,15.73 22.06,16.35 22.06,17.43 17.82,21.66 17.82,27.92 19.85,29.95 19.85,30.17 20.61,30.93 20.61,35.5 21.12,36.01 21.12,36.89 20.58,37.43 v20.58,38.55
  Bottom 0.254: 9.26,37.58 9.08,37.76 v3.09,37.76 | 9.26,37.58 9.42,37.42 19.4,37.42 19.45,37.42 v20.58,38.55 20.58,38.6 21.09,39.11 R4.2 | TP11.P$1 9.36,37.58 9.26,37.58
  Bottom 0.305: v48.34,25.21 48.06,25.49 U1.10
SD_SCLK  (via drill 0.35)
  Top 0.254: J1.P5 4.47,39.92 v3.09,39.92 | v48.24,24.23 48.24,23.83 47.18,22.77 47.18,16.4 47.18,15.23 45.2,13.25 33.29,13.25 31.95,11.91 30.35,11.91 29.85,12.41 25.55,12.41 22.64,15.32 22.51,15.32 21.65,16.18 21.65,17.26 17.41,21.49 17.41,28.23 19.45,30.27 19.45,30.34 20.21,31.1 20.21,35.67 20.71,36.17 20.71,36.72 19.92,37.51 19.92,39.18 v20.08,39.33
  Bottom 0.254: 13.91,38.67 10.42,38.67 9.18,39.92 v3.09,39.92 | TP13.P$1 13.91,38.67 | 13.91,38.67 18.02,38.67 18.68,39.33 v20.08,39.33
  Bottom 0.305: U1.11 48.23,24.22 v48.24,24.23
SD_SW  (via drill 0.35)
  Top 0.254: 21.05,29.88 | v21.97,28.38 22.05,28.38 22.13,28.46 | J1.P9 16.17,39.66 16.37,39.46 16.8,39.03 16.8,35.98 15.66,34.84 15.66,33.94 v16.17,33.43
  Top 0.305: v23.46,27.23 23.37,27.23 22.13,28.46 21.7,28.89 21.7,29.29 21.52,29.47 21.47,29.47 21.05,29.88 21.03,29.86 v21.03,29.84
  Bottom 0.254: R24.P$2 21.55,27.96 v21.97,28.38
  Bottom 0.305: U1.28 27.93,21.68 27.6,22.01 27.6,23.03 23.46,27.17 v23.46,27.23 | v16.17,33.43 17.69,33.43 20.99,30.12 20.99,29.88 v21.03,29.84
SDI/SDA  (via drill 0.35)
  Top 0.305: 36.85,46.52 v36.79,46.58 | 36.85,46.52 37.42,46.52 40.65,46.52 41.08,46.95 48.89,46.95 54.02,41.82 v54.02,39.54 54.9,38.65 54.9,30.9 v54.49,30.48 53.69,29.68 49.67,29.68 v49.11,30.24 | 36.85,46.52 28.38,46.52 25.82,49.08 25.82,55.07 23.18,57.71 J4.P$2
  Bottom 0.254: R16.P$2 v54.02,39.54 | TP15.P$1 56.05,28.92 v54.49,30.48
  Bottom 0.305: U7.P$6 36.43,46.93 v36.79,46.58 | v49.11,30.24 48.78,30.57 U1.6
TX
  Bottom 0.152: 22.72,28.49 22.85,28.36 | 22.87,28.34 22.72,28.49 | 23.76,37.84 24.13,38.2 24.13,39.41 24.13,41.23 20.71,44.65 20.71,44.82 20.35,45.17 20.23,45.17 17.19,48.21 17.19,49.74 13.17,53.76 6.58,53.76 JP1.8 | 23.76,37.84 20.6,34.67 20.6,31.63 21.94,30.28 21.94,29.27 22.72,28.49 | TP6.P$1 23.76,37.84
  Bottom 0.254: U1.37 28.94,33.18 28.07,33.18 27.49,32.6 27.49,31.83 25.6,29.94 24.43,29.94 22.85,28.36 | 22.87,28.34 19.34,24.82 R9.P$1
USB_DN
  Bottom 0.254: U3.5 | U3.5 19.29,16.03 19.29,15.54 21.83,12.99 26.36,12.99 26.4,12.95 28.34,12.95 28.82,13.43 36.51,13.43 36.81,13.13 U2.1
USB_DP
  Bottom 0.254: U3.4 | U3.4 19.69,16.33 19.69,15.7 21.6,13.8 26.12,13.8 26.57,13.35 28.17,13.35 28.65,13.84 38.21,13.84 38.71,13.34 U2.3
VBUS  (via drill 0.35)
  Top 0.508: v41.19,8.68 v37.76,8.68 | v37.76,8.68 36.36,8.68 v35.27,7.58 33.46,9.39 24.59,9.39 21.97,12.01 21.97,12.06 19.73,14.31 17.53,14.31 10.07,21.76 10.07,24.44 12.45,26.81 13.34,26.81 18.38,31.86 18.38,43.34 18.03,43.7 18.03,43.91 17.51,44.43 17.51,45.28 v17.39,45.4 | v4.23,52.19 4.1,52.31 4.1,52.44 4.08,52.47 4.08,53.03 JP1.1 | v37.76,8.68
  Bottom 0.508: J2.B4A9 35.41,7.34 35.27,7.49 v35.27,7.58 | v41.19,8.68 40.11,7.6 J2.A4B9 | U2.5 v37.76,8.68 | v4.23,52.19 4.23,51.22 10.03,45.41 v17.38,45.41 v17.39,45.4
  pour Bottom (no thermals): 40.81,8.3 43.98,8.3 43.98,7.91 46.78,7.91 46.78,9.31 45.25,9.31 45.25,10.71 40.81,10.71
VBUS_FILTERED  (via drill 0.35)
  Top 0.813: v54.14,8.8 54.78,8.17 54.78,7.91
  Bottom 0.254: LED1.P$5 27.35,3.72 27.35,3.98 v27.6,4.23 | LED1.P$1 30.52,2.83 v31.03,2.83 31.46,2.83 C17.P$2 | LED4.P$1 2.83,45 3.67,45 v3.9,45.23 2.66,43.98 C20.P$2 | LED2.P$1 13.88,10.96 v14.65,10.96 | LED2.P$5 v11.85,13.63 | LED3.P$1 3.85,26.58 4.36,26.08 v4.36,25.95 4.36,25.26 C19.P$2 | LED3.P$5 v3.34,29.89 | LED4.P$5 v3.98,48.05 | LED5.P$1 11.09,61.64 11.22,61.51 v11.22,61.23 C21.P$2 | LED6.P$1 26.58,71.67 26.58,71.29 v26.33,71.03 25.14,71.03 C22.P$2 | LED6.P$5 v29.89,72.18 | LED7.P$5 v48.17,71.54 | LED7.P$1 45,72.68 44.62,72.3 v44.49,72.3 43.88,72.91 C23.P$2 | LED8.P$5 v63.67,61.89 | LED8.P$1 61.64,64.43 61.13,64.43 v60.87,64.68 60.84,64.68 C24.P$2 | LED9.P$5 v72.18,45.63 | LED9.P$1 71.67,48.94 v71.16,49.44 71.16,50.26 C25.P$2 | LED11.P$5 v61.89,11.85 | LED11.P$1 64.43,13.88 64.43,14.52 v64.56,14.65 64.65,14.65 C27.P$2 | LED12.P$1 48.94,3.85 v49.44,4.36 49.64,4.55 C28.P$2 | C18.P$2 14.65,10.87 v14.65,10.96 | C26.P$2 72.86,31.46 v72.43,31.03 73.27,30.18 LED10.P$1 | LED12.P$5 46.06,2.47 45.71,2.81 v45.71,3.36 | v14.65,10.96 16.67,12.99 C8.P$1 C11.P$1 U3.8 | R14.P$2 25.87,7.15 25.19,6.47 24.88,6.16 v24.88,5.68 | LED10.P$5 v71.41,27.5 | LED5.P$5 13.51,63.77 v13.51,63.67
  Bottom 0.305: U8.8 62.79,27.98 U8.7
  Bottom 0.508: 62.79,27.98 62.78,27.99 C32.P$1 C33.P$1 60.42,26.21 R19.P$1 60.55,25.08 63.85,21.78 64.28,21.35 JP2.1 65.98,20.11 v66.99,19.09
  pour Top (rank 4): -1.36,82.97 81.32,82.97 81.32,-8.34 -1.99,-8.34 -1.99,-7.83
  pour Bottom (no thermals): 50.59,12.61 50.59,9.18 48.05,9.18 48.05,8.04 54.9,8.04 54.9,12.61

### Text on the board
SilkscreenTop: GLYPH READER | GND / SCL / SDA / 3v3 | Rev 1 - 2026 | 600-0047-01
SilkscreenBottom: BOOT | RESET | + | - | - + | GND / / V+